# EAGLE board mainboard (EAGLE 7.7.0), part 1 of 4
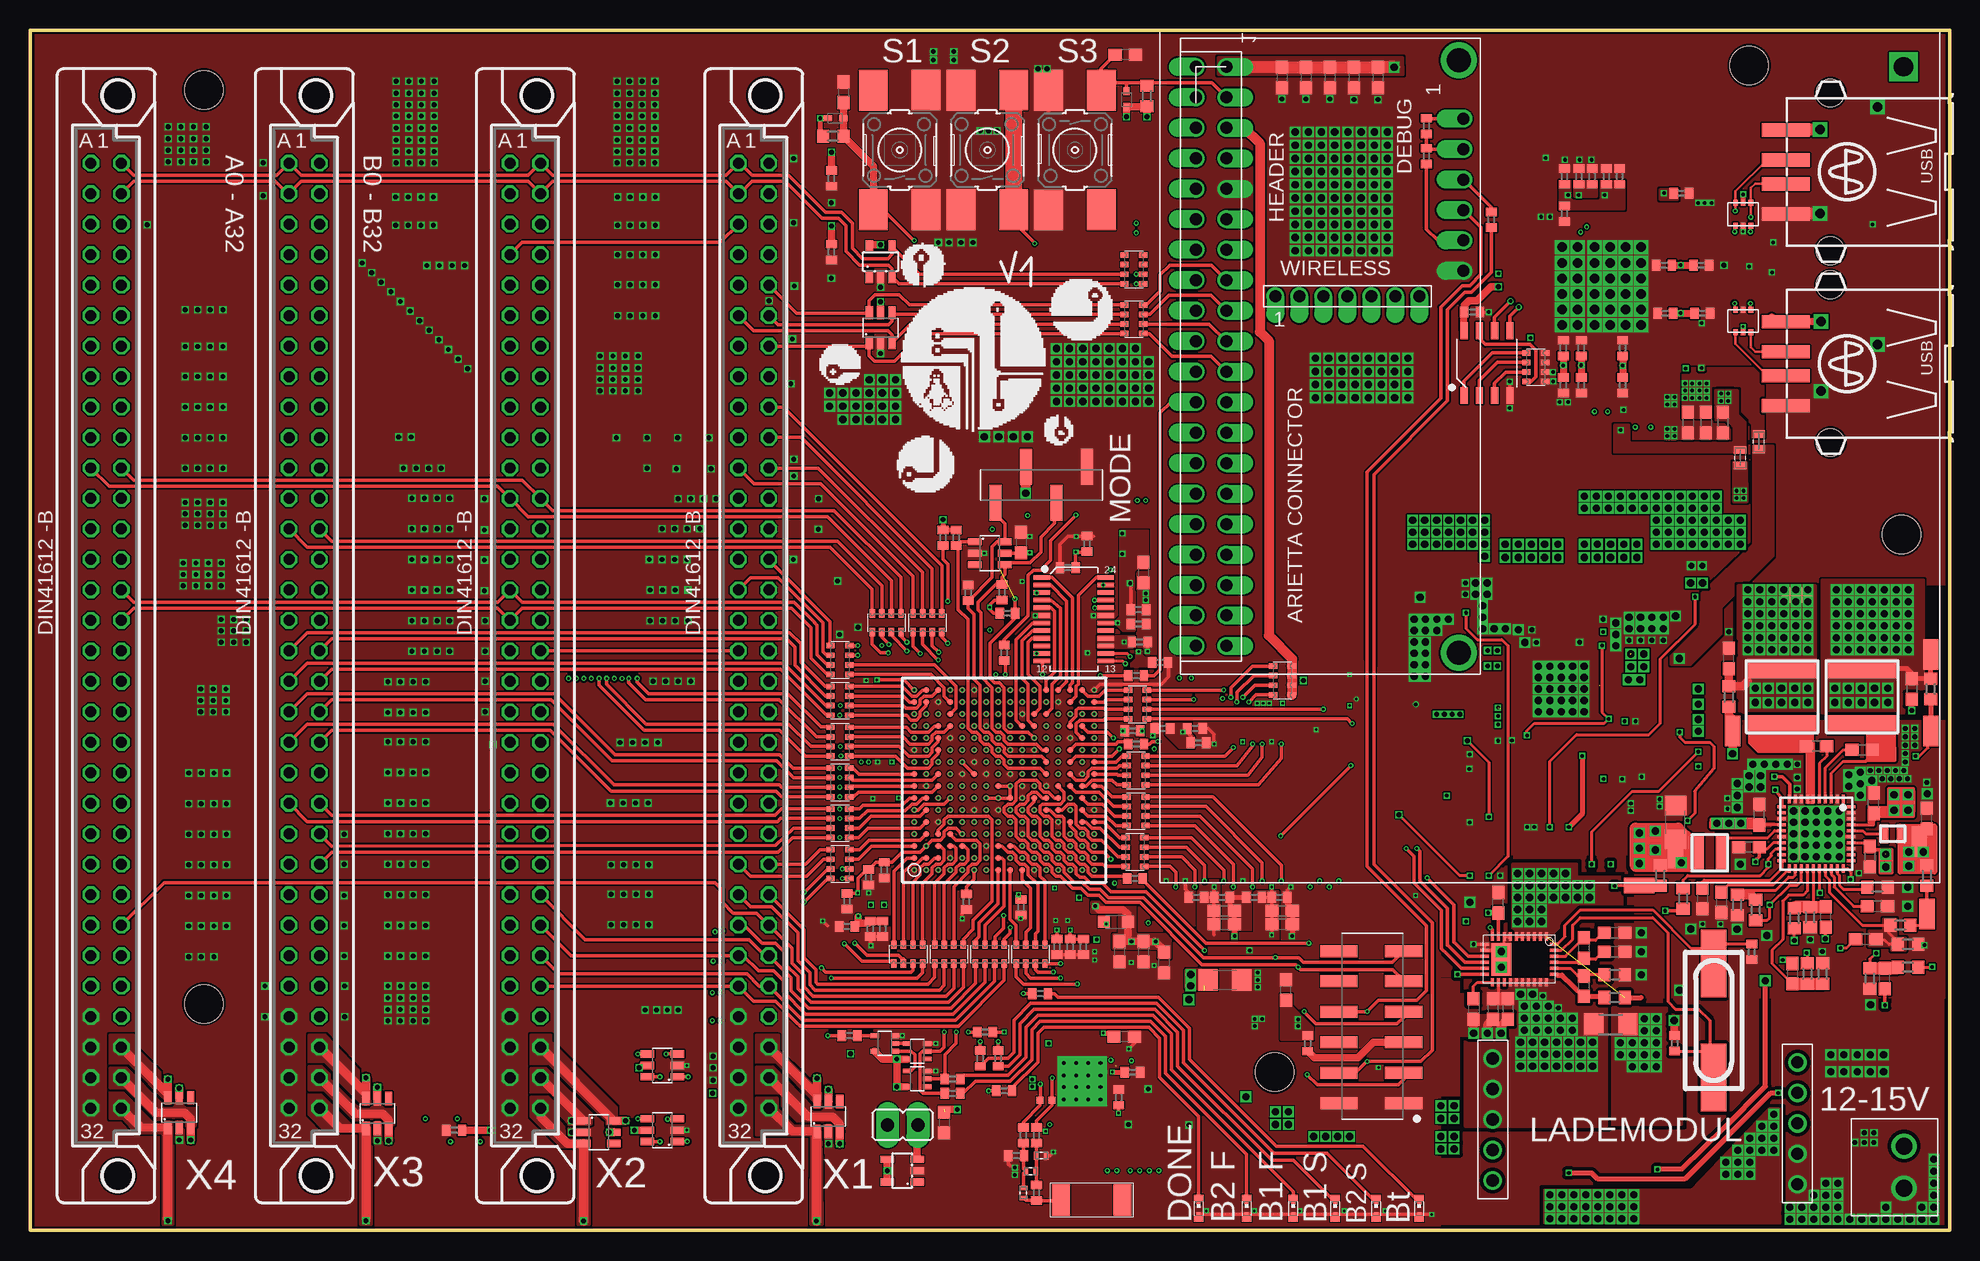
[diagram p6: board, top side]
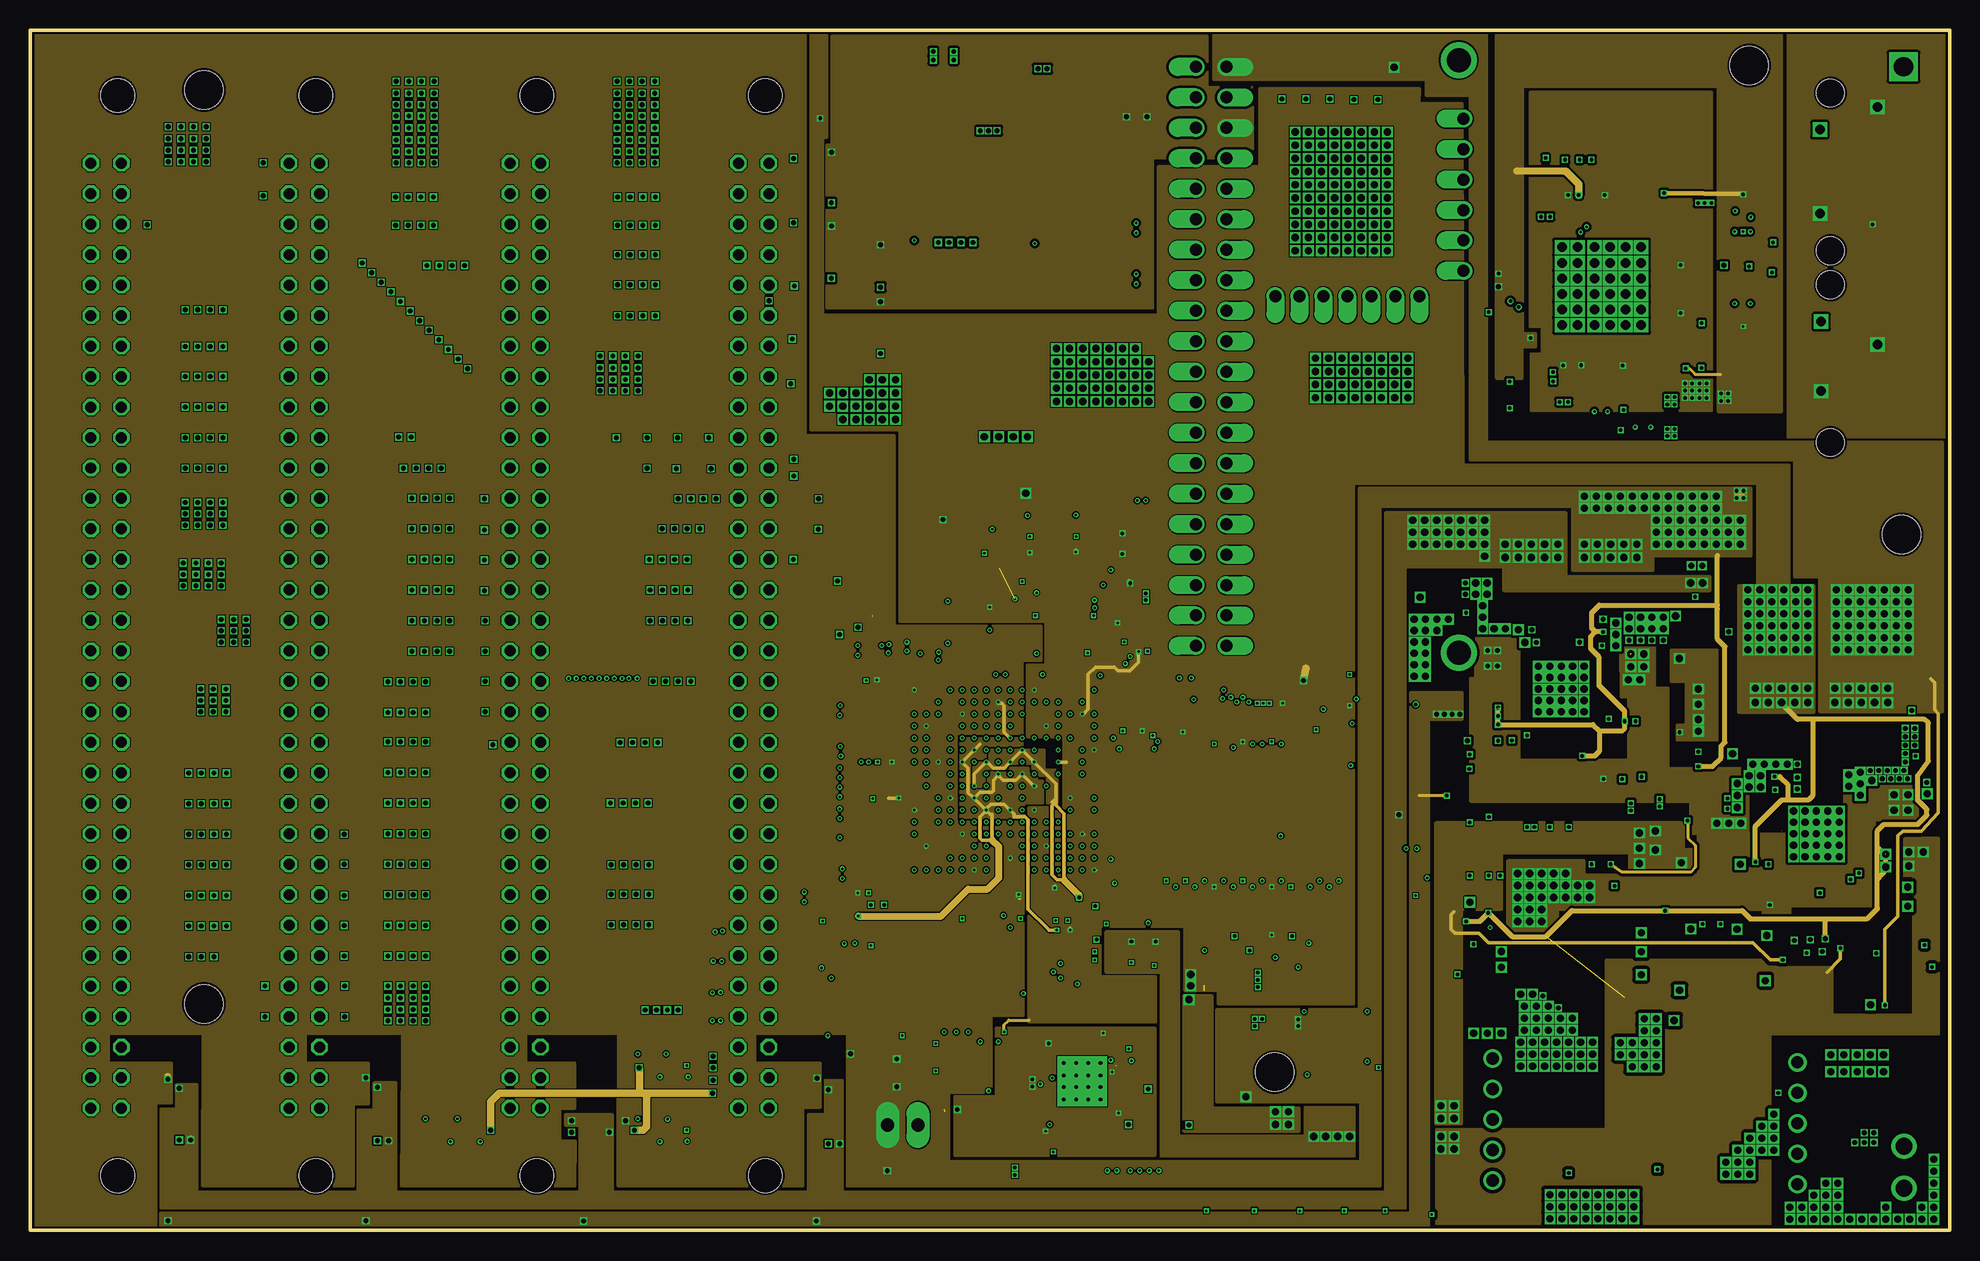
[diagram p7: board, inner layer VCC]
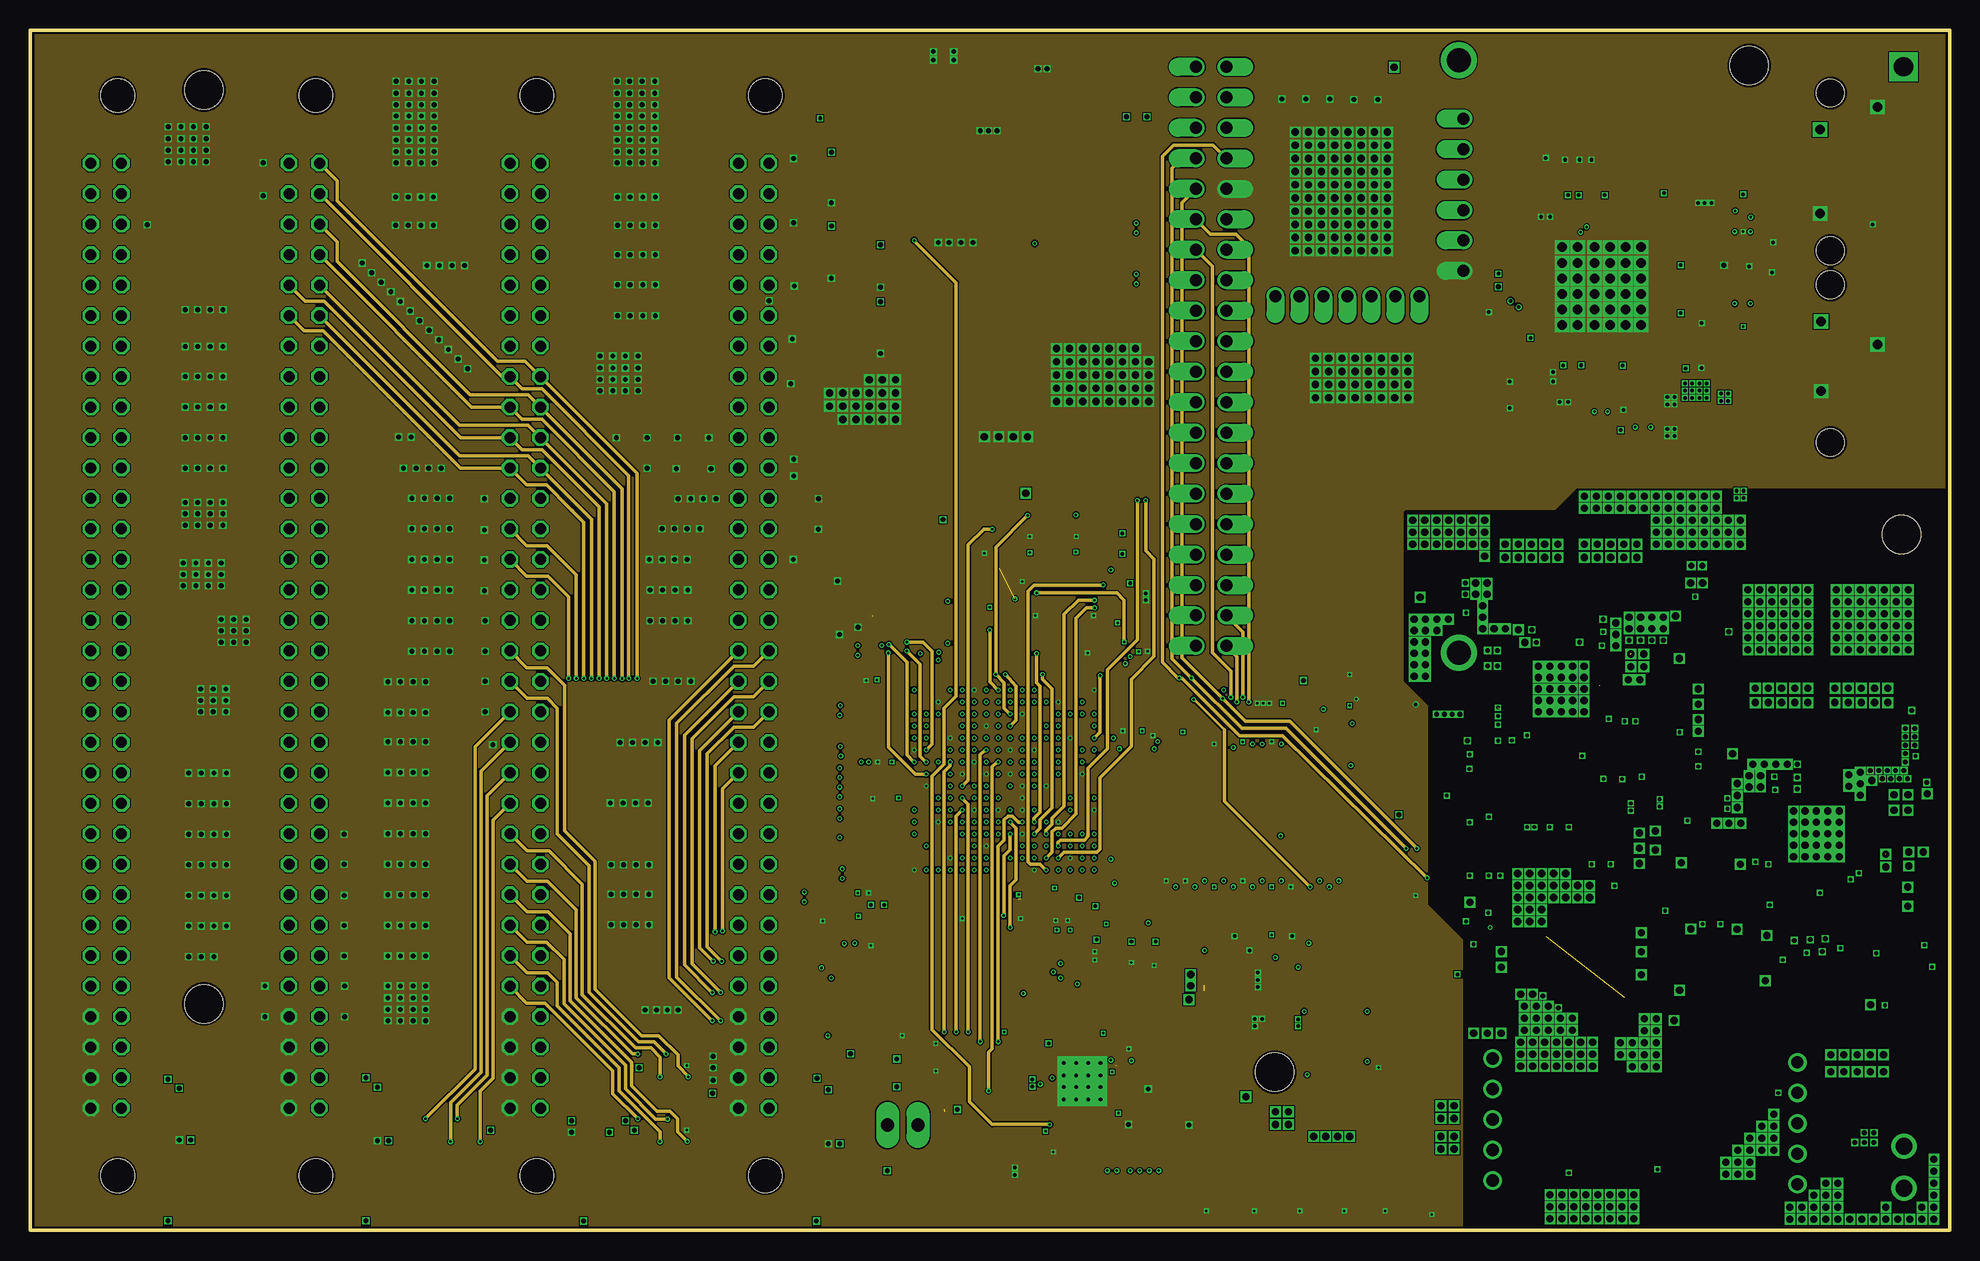
[diagram p8: board, inner layer FastSignal_Top]
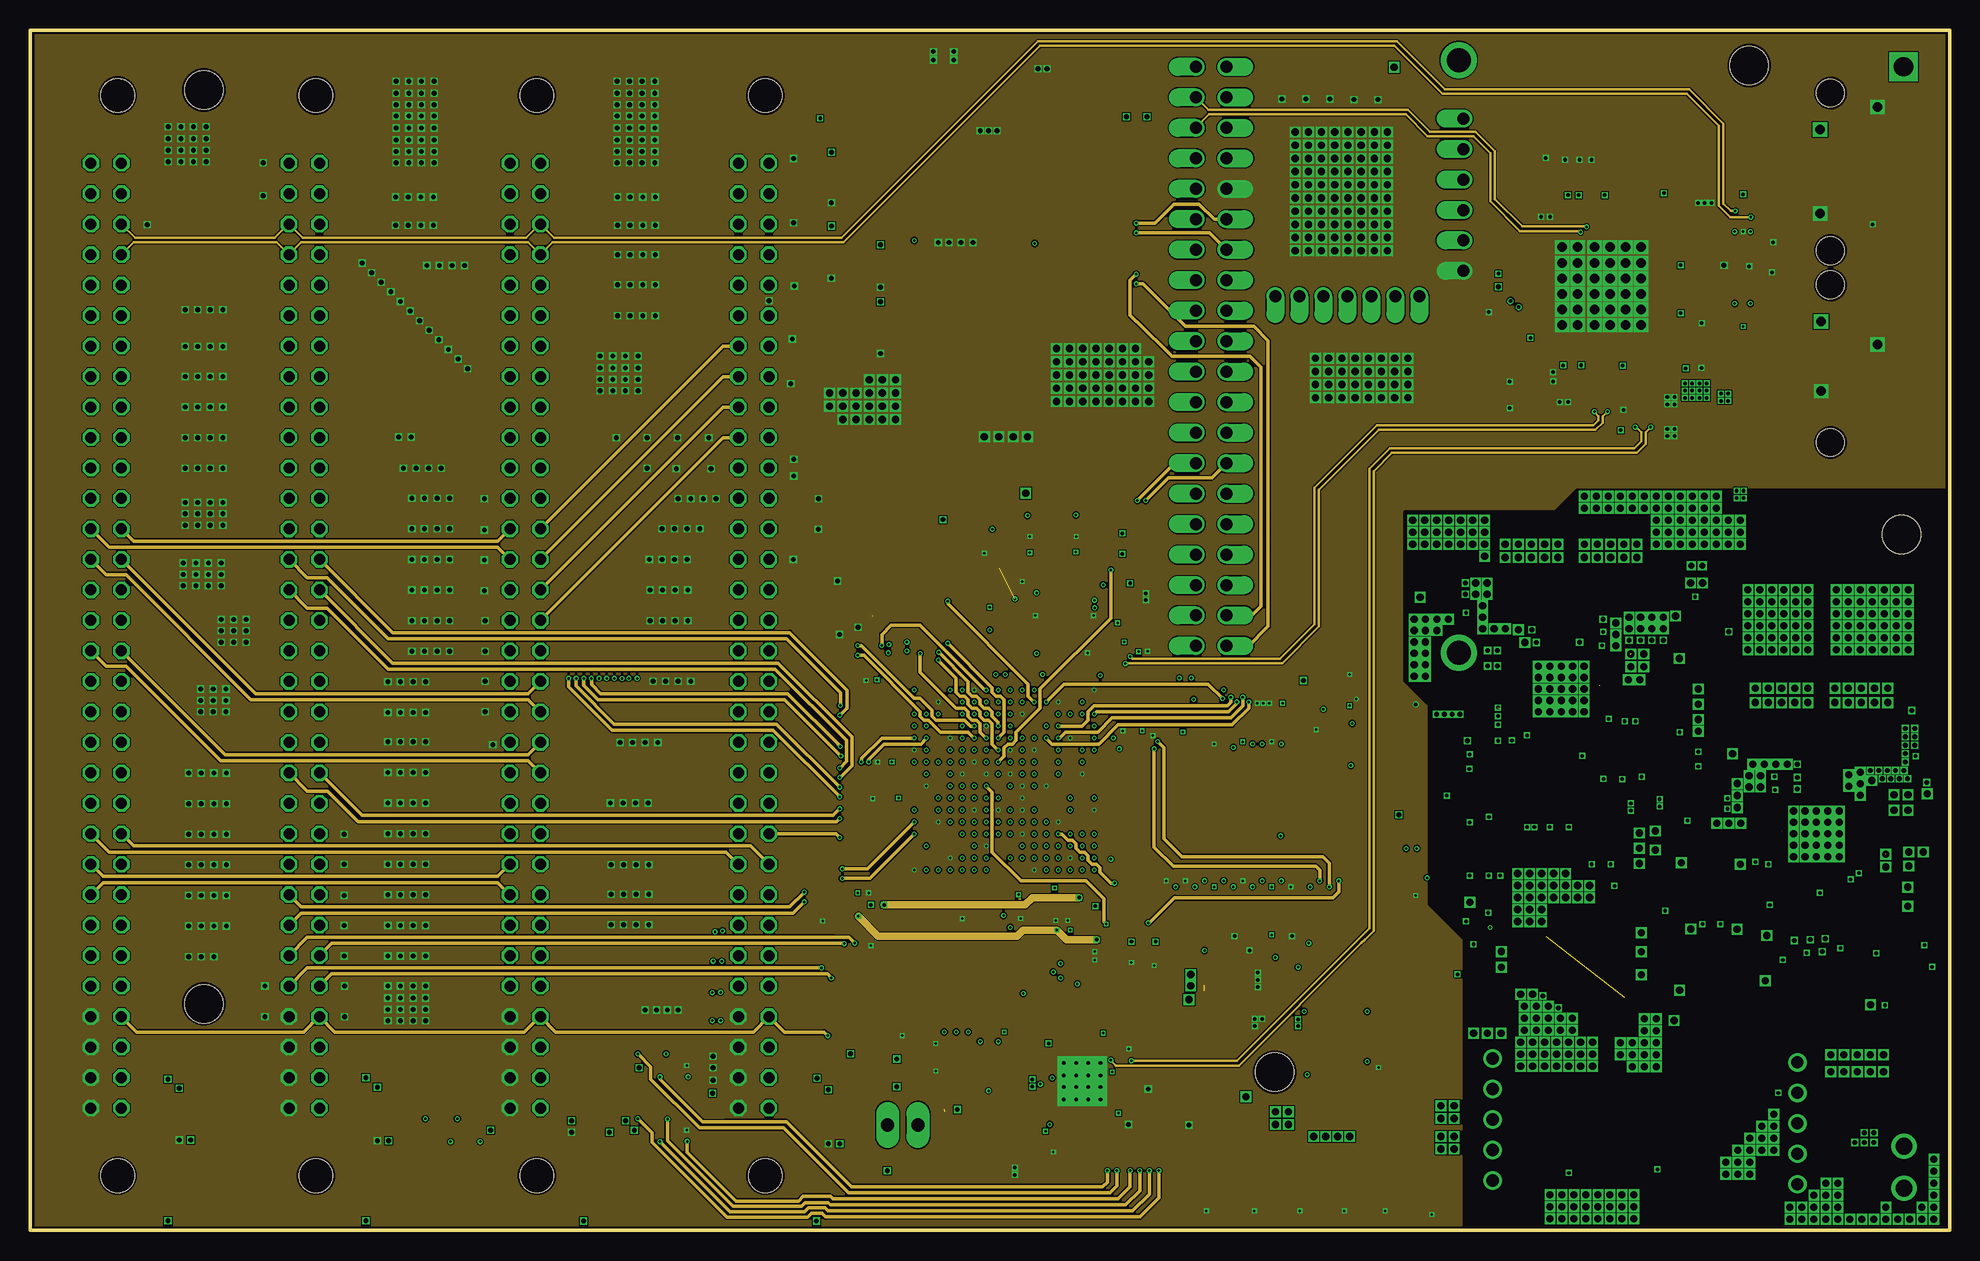
[diagram p9: board, inner layer FastSignal_Bottom]
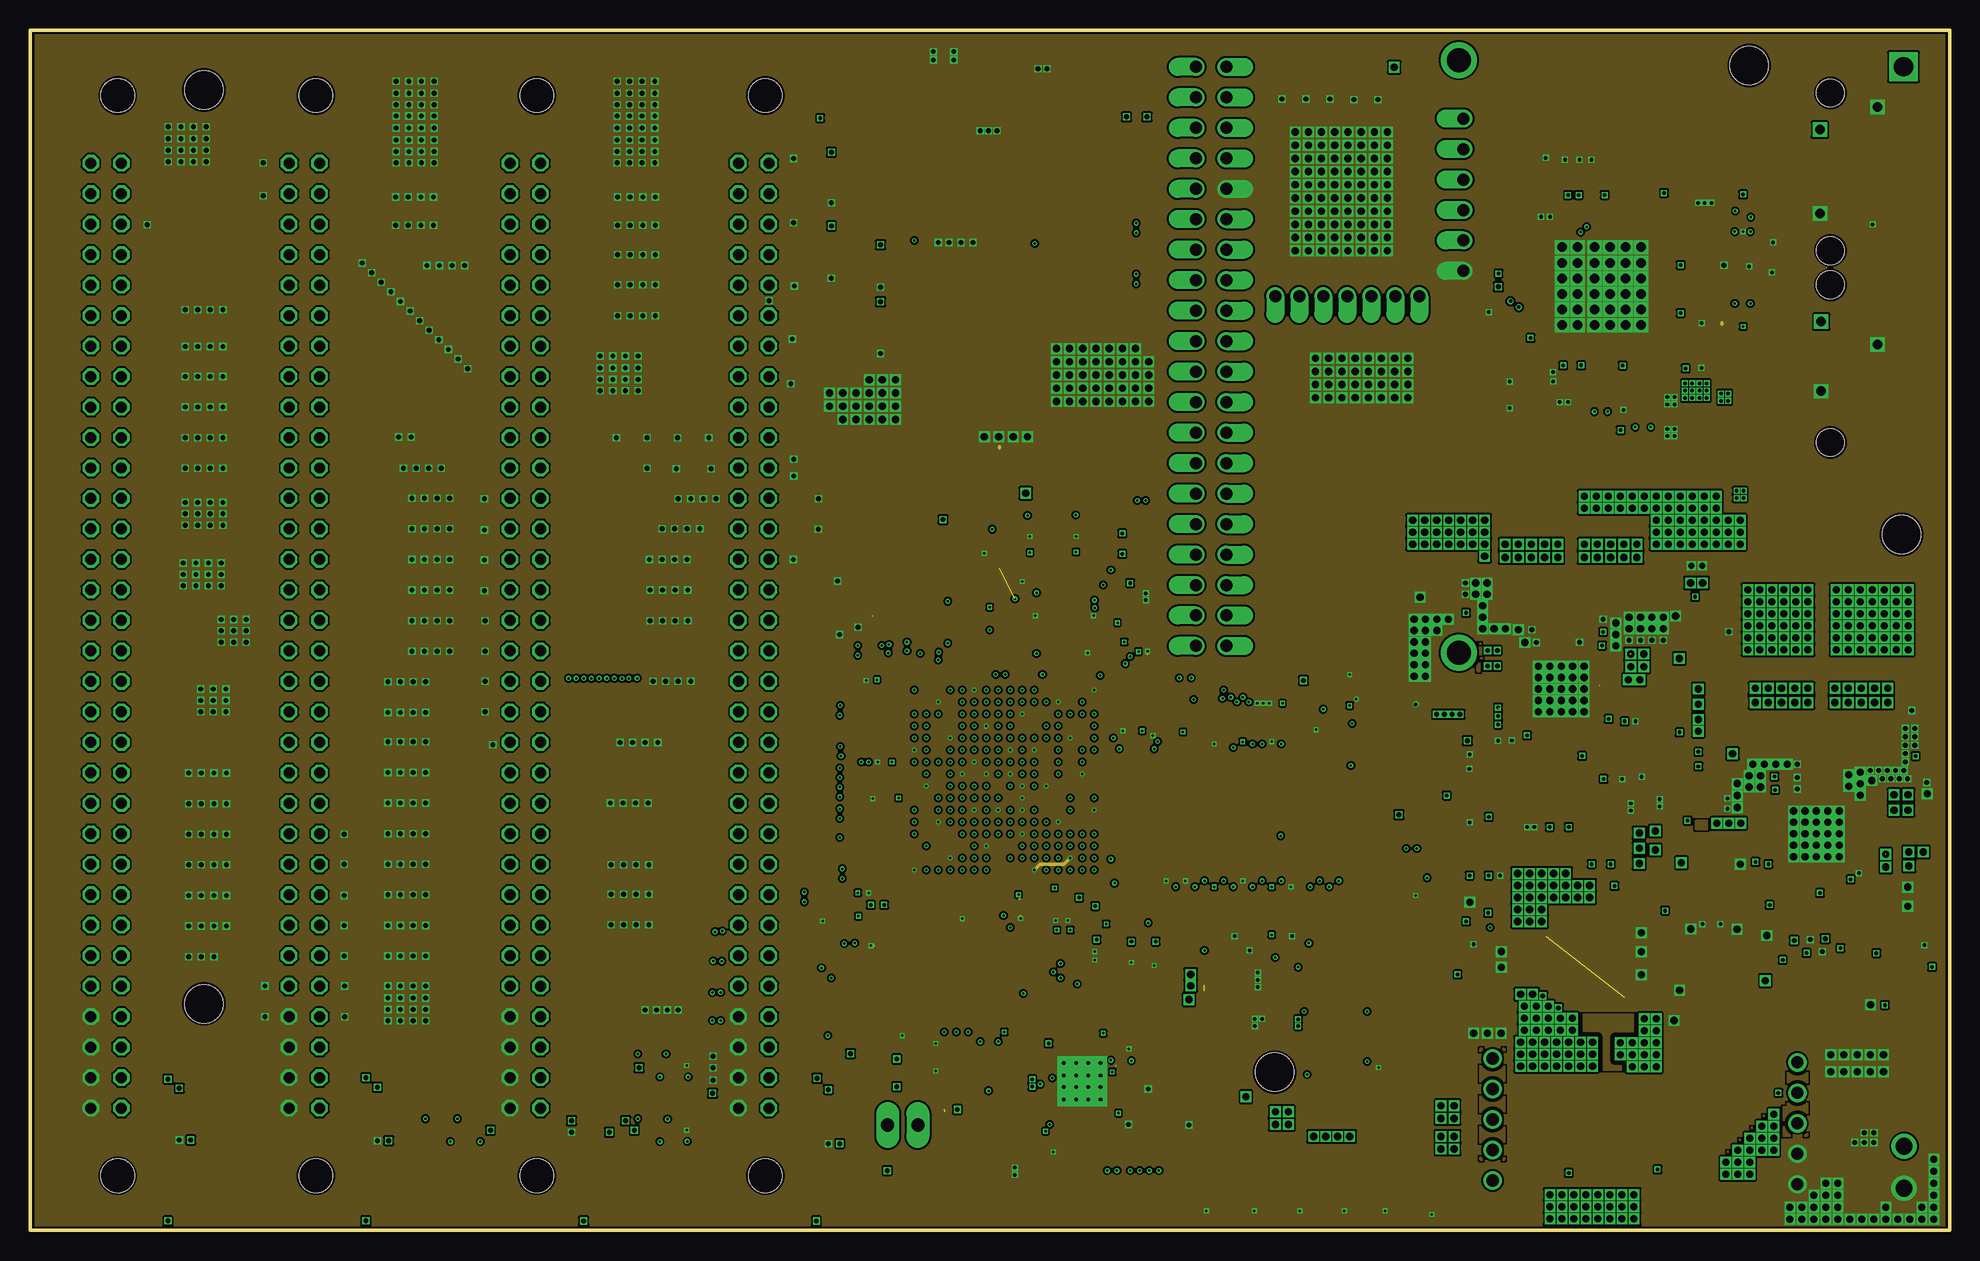
[diagram p10: board, inner layer GND]
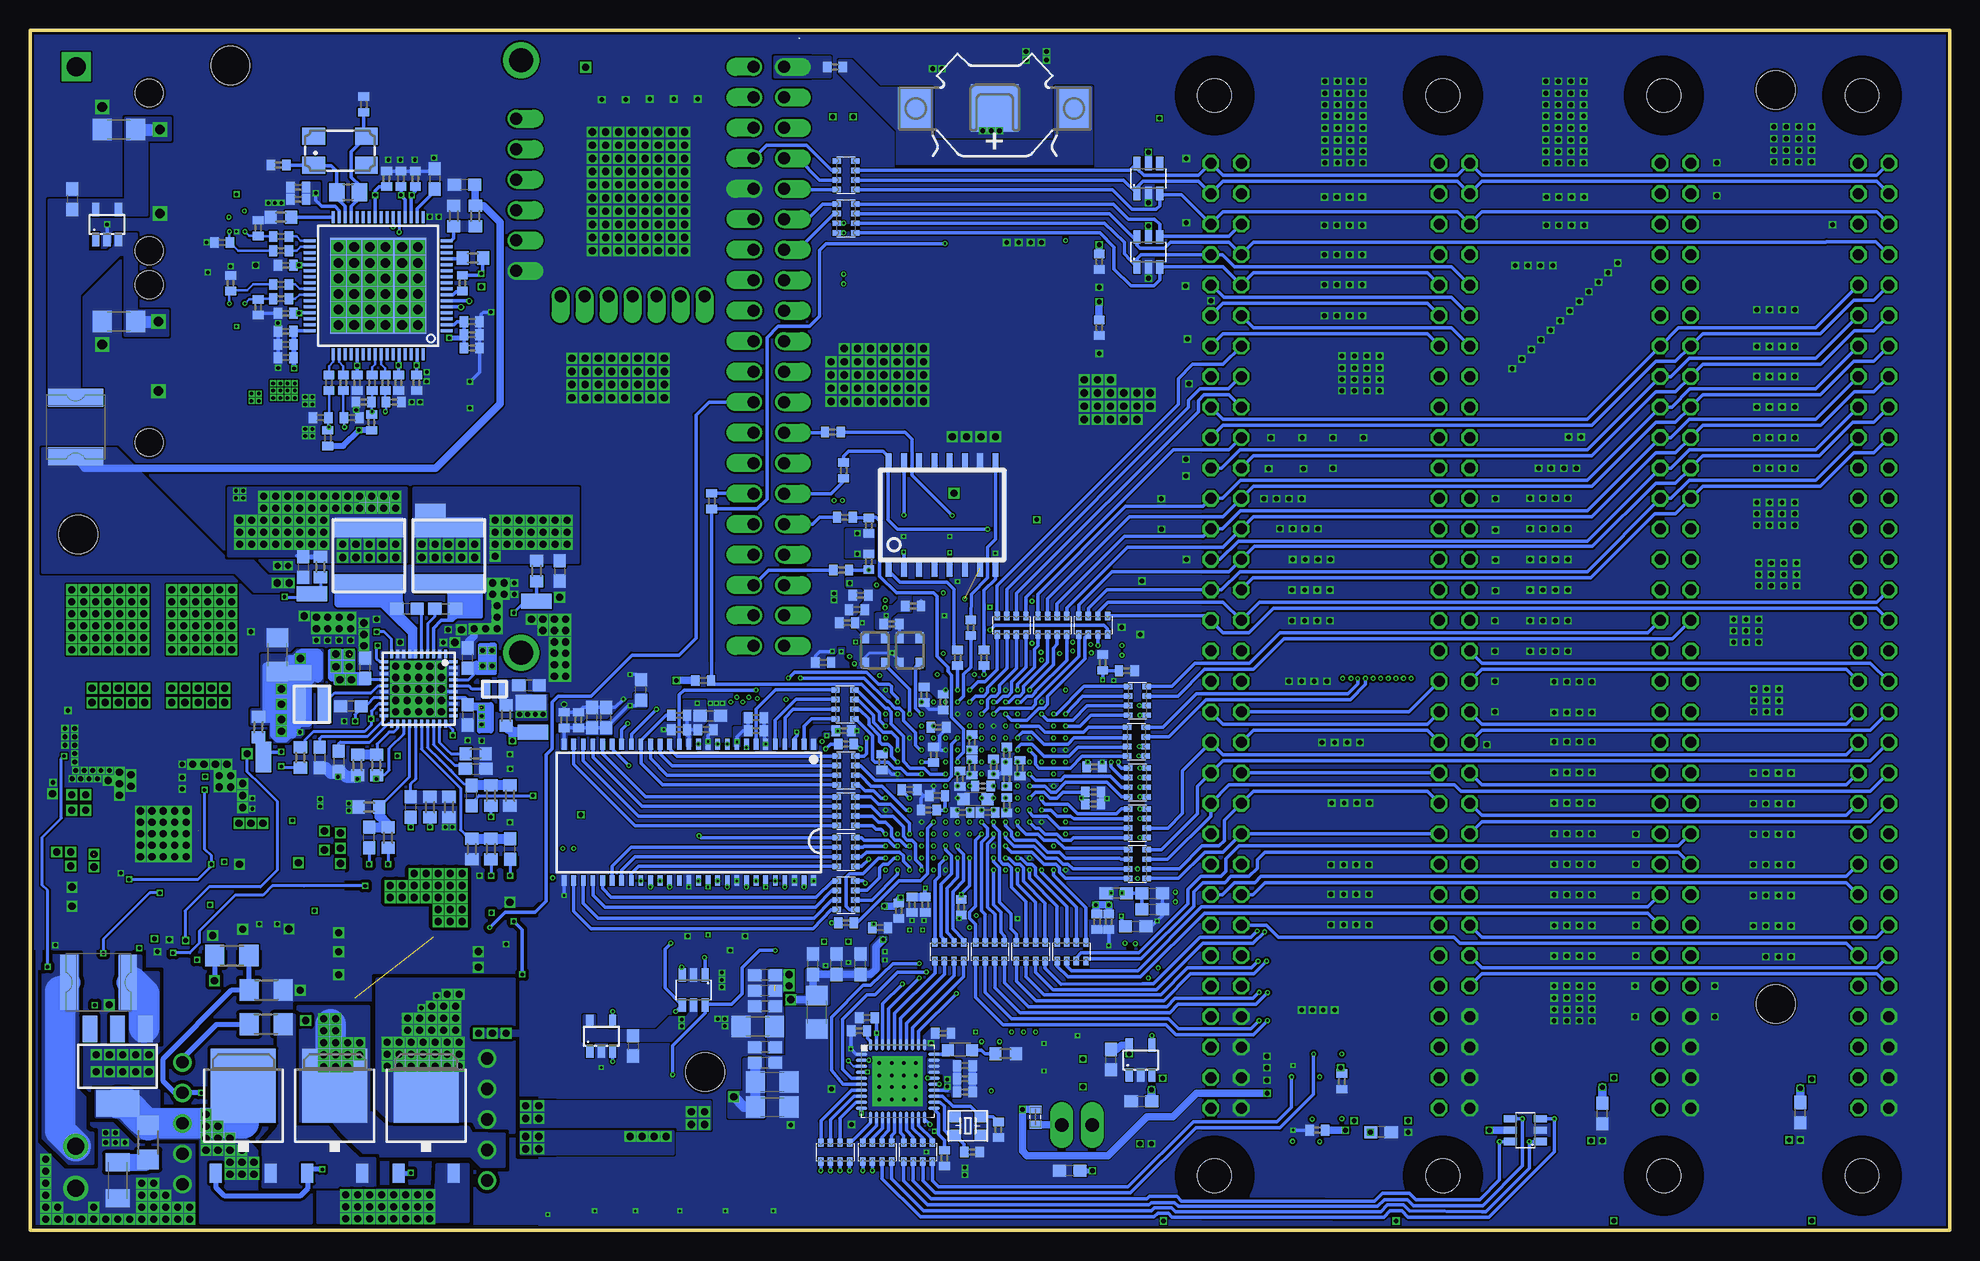
[diagram p11: board, bottom side, seen from below]

Size 160 x 100 mm. Coordinates in mm from the lower left corner, seen from the top.
Outline: 0,0 160,0 160,100 0,100 0,0
Copper layers (1+2*3+14*15+16): Signal_Top 0.018mm / dielectric 0.2mm / VCC 0.035mm / dielectric 0.36mm / FastSignal_Top 0.035mm / dielectric 0.3mm / FastSignal_Bottom 0.035mm / dielectric 0.36mm / GND 0.035mm / dielectric 0.2mm / Signal_Bottom 0.018mm
Design rules "Multi-CB_6L_100um-Tracks_OL35um-IL35um *": minimum track width 0.1mm, minimum drill 0.2mm, track to track 0.1mm, track to pad 0.1mm, pad to pad 0.1mm, via to via 0.1mm, smd to smd 0mil, copper to edge 0.2mm, drill to drill 0.2mm, minimum pad ring 0.1mm, minimum via ring 0.1mm, stop-mask expansion 2mil, vias tented up to drill 0.45mm, thermal gap 0.2mm
Net classes: 1 50 Ohm: width 0.381 mm, drill 0.203 mm; 2 58 Ohm: width 0.305 mm, drill 0.203 mm; 3 75 Ohm: width 0.203 mm, drill 0.203 mm; 4 100 Ohm: width 0.102 mm, drill 0.203 mm; 5 Power 2A: width 0.813 mm, drill 0.406 mm; 6 Power 1A: width 0.381 mm, drill 0.203 mm; 7 Power 0.5A: width 0.203 mm, drill 0.203 mm; 8 GND_signal: width 0.305 mm, drill 0.203 mm; 9 GND_default: width 0.381 mm, drill 0.203 mm; 10 GND_power: width 0.813 mm, drill 0.406 mm
Holes 3.2 mm at 14.5,18.85 14.5,95 143.3,97.05 156,57.95 103.75,13.15
bKeepout: area 58.1,28.4 to 58.2,28.6
tRestrict: area 69.2,16.4 to 70.2,16.9; area 75.2,11.6 to 75.9,12.4; area 79.7,13.1 to 80.3,14.1; area 83.3,8.9 to 83.7,9.3; area 82.9,3.7 to 83.8,6.8; area 72.6,13.3 to 73.6,14.1; area 83.9,19.1 to 84.5,20.4; area 79,24.1 to 79.5,24.6; area 83.2,24.1 to 84.5,24.9; area 77.3,28.4 to 77.9,28.9; area 74.5,31.2 to 76,32.1; area 76,32 to 76.8,32.6; 69 more areas
bRestrict: area 73.6,38.6 to 75.6,39.4; area 75,39.6 to 75.7,40.3; area 67.2,29 to 68.2,43.9; area 80.2,39.2 to 81,39.8; area 77,39.5 to 77.5,40.3; area 83.4,38.2 to 84.2,38.8; area 80.3,36.5 to 80.9,37.7; area 79.1,35.3 to 79.8,36.6; area 79,33.5 to 79.5,34.2; area 84.5,30.2 to 85,30.9; area 85.4,31.2 to 86,31.7; area 87.5,33.3 to 88,33.8; 37 more areas

## Footprints (pad centres in the part's own frame; a part is rotated, then mirrored left to right if it is on the bottom)
SWRA092B = smd 1.5 x 2.6: 1 -2.55,0; 2 2.55,0
C0402 = smd 0.7 x 0.9: 1 -0.65,0; 2 0.65,0
C0603 = smd 1.1 x 1: 1 -0.85,0; 2 0.85,0
C1206 = smd 1.6 x 1.8: 1 -1.4,0; 2 1.4,0
C1206K = smd 1.5 x 2: 1 -1.5,0; 2 1.5,0
WE-TVS_SOT23-6L = smd 0.6 x 1.1: 1 -0.95,-1.25; 2 0,-1.25; 3 0.95,-1.25; 4 0.95,1.25; 5 0,1.25; 6 -0.95,1.25
WE-TVS_SOT23-5L = smd 0.6 x 1.1: 1 -0.95,-1.25; 2 0,-1.25; 3 0.95,-1.25; 4 0.95,1.25; 5 -0.95,1.25
SOD523 = smd 0.7 x 0.5: A 0.7,0; C -0.6,0
SOT223 = smd 1.219 x 2.235: 1 -2.311,-3.099; 2 0,-3.099; 3 2.311,-3.099 | smd 3.6 x 2.2: 4 0,3.099
10MM_SM_COIN_CELL_CLIP = smd 2.9 x 3.5: +@1 -6.6,0; +@2 6.6,0 | smd 3.96 x 3.96: - 0,0
S25FL128P = smd 0.5 x 1.4: CS# 3.175,-4.45; GND 3.175,4.44; HOLD# -4.445,-4.45; NC -1.905,-4.45; PO0 1.905,-4.45; PO1 0.635,-4.45; PO2 -0.635,-4.45; PO3 1.905,4.44; PO4 0.635,4.44; PO5 -0.635,4.44; PO6 -1.905,4.44; SCK -4.445,4.44; SI -3.175,4.44; SO/PO7 4.445,-4.45; VCC -3.175,-4.45; WP#ACC 4.445,4.44
SSOP24-0.635-8.65X4MM = smd 0.381 x 1.397: 1 -3.493,-2.667; 2 -2.857,-2.667; 3 -2.223,-2.667; 4 -1.587,-2.667; 5 -0.953,-2.667; 6 -0.318,-2.667; 7 0.318,-2.667; 8 0.953,-2.667; 9 1.587,-2.667; 10 2.223,-2.667; 11 2.857,-2.667; 12 3.493,-2.667; 13 3.493,2.667; 14 2.857,2.667; 15 2.223,2.667; 16 1.587,2.667; 17 0.953,2.667; 18 0.318,2.667; 19 -0.318,2.667; 20 -0.953,2.667; 21 -1.587,2.667; 22 -2.223,2.667; 23 -2.857,2.667; 24 -3.493,2.667
QFN40-6X6 = smd 0.95 x 0.28: 1 -3.025,2.25; 2 -3.025,1.75; 3 -3.025,1.25; 4 -3.025,0.75; 5 -3.025,0.25; 6 -3.025,-0.25; 7 -3.025,-0.75; 8 -3.025,-1.25; 9 -3.025,-1.75; 10 -3.025,-2.25; 21 3.025,-2.25; 22 3.025,-1.75; 23 3.025,-1.25; 24 3.025,-0.75; 25 3.025,-0.25; 26 3.025,0.25; 27 3.025,0.75; 28 3.025,1.25; 29 3.025,1.75; 30 3.025,2.25 | smd 0.28 x 0.95: 11 -2.25,-3.025; 12 -1.75,-3.025; 13 -1.25,-3.025; 14 -0.75,-3.025; 15 -0.25,-3.025; 16 0.25,-3.025; 17 0.75,-3.025; 18 1.25,-3.025; 19 1.75,-3.025; 20 2.25,-3.025; 31 2.25,3.025; 32 1.75,3.025; 33 1.25,3.025; 34 0.75,3.025; 35 0.25,3.025; 36 -0.25,3.025; 37 -0.75,3.025; 38 -1.25,3.025; 39 -1.75,3.025; 40 -2.25,3.025 | drill 0.3 pad 1.1 square: EXP@1 -1.525,1.525; EXP@2 -0.5,1.525; EXP@3 0.5,1.525; EXP@4 1.525,1.525; EXP@5 -1.525,0.475; EXP@6 -0.5,0.475; EXP@7 0.5,0.475; EXP@8 1.525,0.475; EXP@9 -1.525,-0.475; EXP@10 -0.5,-0.475; EXP@11 0.5,-0.475; EXP@12 1.525,-0.475; EXP@13 -1.525,-1.525; EXP@14 -0.5,-1.525; EXP@15 0.5,-1.525; EXP@16 1.525,-1.525
LT8602 = smd 0.7 x 0.25: BIAS -2.9,-2.25; BST1 -2.9,0.75; BST2 -2.9,0.25; EN/UVLO 2.9,-1.75; FB1 2.9,0.25; FB2 2.9,-0.25; FB3 2.9,0.75; FB4 2.9,-0.75; GND_2 -2.9,1.75; GND_3 -2.9,-1.25; GND_4 -2.9,-1.75; INTVCC 2.9,1.25; PG1 -2.9,2.25; RT 2.9,1.75; RUN3 2.9,2.25; SW1 -2.9,1.25; SW2 -2.9,-0.25; SW2_2 -2.9,-0.75; TRKSS1 2.9,-2.25; VIN 2.9,-1.25 | smd 0.25 x 0.7: CPOR 2.25,2.9; GND_5 -1.25,-2.9; GND_6 0.25,-2.9; GND_7 -1.25,2.9; GND_8 0.25,2.9; NC 1.75,-2.9; PG2 -2.25,-2.9; PG3 -2.25,2.9; PG4 -1.75,-2.9; POREN -1.75,2.9; PVIN1 -0.75,2.9; PVIN2 -0.75,-2.9; PVIN3 0.75,2.9; PVIN4 0.75,-2.9; RST 1.75,2.9; RUN4 1.25,-2.9; SW3 -0.25,2.9; SW4 -0.25,-2.9; SYNC 1.25,2.9; TRKSS2 2.25,-2.9 | smd 4.42 x 4.42: GND_1 0,0
HTQFP-64-EXP = smd 1 x 0.25: 1 -5.7,3.75; 2 -5.7,3.25; 3 -5.7,2.75; 4 -5.7,2.25; 5 -5.7,1.75; 6 -5.7,1.25; 7 -5.7,0.75; 8 -5.7,0.25; 9 -5.7,-0.25; 10 -5.7,-0.75; 11 -5.7,-1.25; 12 -5.7,-1.75; 13 -5.7,-2.25; 14 -5.7,-2.75; 15 -5.7,-3.25; 16 -5.7,-3.75; 33 5.7,-3.75; 34 5.7,-3.25; 35 5.7,-2.75; 36 5.7,-2.25; 37 5.7,-1.75; 38 5.7,-1.25; 39 5.7,-0.75; 40 5.7,-0.25; 41 5.7,0.25; 42 5.7,0.75; 43 5.7,1.25; 44 5.7,1.75; 45 5.7,2.25; 46 5.7,2.75; 47 5.7,3.25; 48 5.7,3.75 | smd 0.25 x 1: 17 -3.75,-5.7; 18 -3.25,-5.7; 19 -2.75,-5.7; 20 -2.25,-5.7; 21 -1.75,-5.7; 22 -1.25,-5.7; 23 -0.75,-5.7; 24 -0.25,-5.7; 25 0.25,-5.7; 26 0.75,-5.7; 27 1.25,-5.7; 28 1.75,-5.7; 29 2.25,-5.7; 30 2.75,-5.7; 31 3.25,-5.7; 32 3.75,-5.7; 49 3.75,5.7; 50 3.25,5.7; 51 2.75,5.7; 52 2.25,5.7; 53 1.75,5.7; 54 1.25,5.7; 55 0.75,5.7; 56 0.25,5.7; 57 -0.25,5.7; 58 -0.75,5.7; 59 -1.25,5.7; 60 -1.75,5.7; 61 -2.25,5.7; 62 -2.75,5.7; 63 -3.25,5.7; 64 -3.75,5.7 | smd 8 x 8: EXP 0,0
LTC2947 = smd 0.25 x 0.7: AD0 1.75,-1.9; AD1/CS 2.25,-1.9; AGND 0.75,-1.9; AVCC 0.75,1.9; BYP 2.25,1.9; DGND 1.25,-1.9; DNC 1.25,1.9; DVCC 1.75,1.9; IM_1 -2.25,-1.9; IM_2 -1.75,-1.9; IM_3 -1.25,-1.9; IM_4 -0.75,-1.9; IM_5 -0.25,-1.9; IM_6 0.25,-1.9; IP_1 -2.25,1.9; IP_2 -1.75,1.9; IP_3 -1.25,1.9; IP_4 -0.75,1.9; IP_5 -0.25,1.9; IP_6 0.25,1.9 | smd 0.7 x 0.25: ALERT 2.9,-0.75; CFM -2.9,-0.25; CFP -2.9,0.25; CKLI -2.9,-0.75; CLKO -2.9,-1.25; GPIO 2.9,-1.25; OVDD 2.9,1.25; SCL 2.9,-0.25; SDI 2.9,0.75; SDO 2.9,0.25; VM -2.9,0.75; VP -2.9,1.25 | smd 1.7 x 2.7: DGND_2 1.5,0
SC70-5 = smd 0.4 x 0.7: 1 -0.65,-0.85; 2 0,-0.85; 3 0.65,-0.85; 4 0.65,0.85; 5 -0.65,0.85
SOIC-8 = smd 0.6 x 1.4: 1 -1.905,-2.7; 2 -0.635,-2.7; 3 0.635,-2.7; 4 1.905,-2.7; 5 1.905,2.7; 6 0.635,2.7; 7 -0.635,2.7; 8 -1.905,2.7
TSOP54-400 = smd 0.4 x 0.9: 1 -10.4,-5.68; 2 -9.6,-5.68; 3 -8.8,-5.68; 4 -8,-5.68; 5 -7.2,-5.68; 6 -6.4,-5.68; 7 -5.6,-5.68; 8 -4.8,-5.68; 9 -4,-5.68; 10 -3.2,-5.68; 11 -2.4,-5.68; 12 -1.6,-5.68; 13 -0.8,-5.68; 14 0,-5.68; 15 0.8,-5.68; 16 1.6,-5.68; 17 2.4,-5.68; 18 3.2,-5.68; 19 4,-5.68; 20 4.8,-5.68; 21 5.6,-5.68; 22 6.4,-5.68; 23 7.2,-5.68; 24 8,-5.68; 25 8.8,-5.68; 26 9.6,-5.68; 27 10.4,-5.68; 28 10.4,5.68; 29 9.6,5.68; 30 8.8,5.68; 31 8,5.68; 32 7.2,5.68; 33 6.4,5.68; 34 5.6,5.68; 35 4.8,5.68; 36 4,5.68; 37 3.2,5.68; 38 2.4,5.68; 39 1.6,5.68; 40 0.8,5.68; 41 0,5.68; 42 -0.8,5.68; 43 -1.6,5.68; 44 -2.4,5.68; 45 -3.2,5.68; 46 -4,5.68; 47 -4.8,5.68; 48 -5.6,5.68; 49 -6.4,5.68; 50 -7.2,5.68; 51 -8,5.68; 52 -8.8,5.68; 53 -9.6,5.68; 54 -10.4,5.68
61001221121 = smd 1 x 3.1: 1 -6.35,-2.7; 2 -3.81,-2.7; 3 -1.27,-2.7; 4 1.27,-2.7; 5 3.81,-2.7; 6 6.35,-2.7; 7 6.35,2.7; 8 3.81,2.7; 9 1.27,2.7; 10 -1.27,2.7; 11 -3.81,2.7; 12 -6.35,2.7
61000418221 = smd 1 x 3: 1 -3.81,-1.5; 2 -1.27,1.5; 3 1.27,-1.5; 4 3.81,1.5
691321100002 = drill 1.4: 1 -3.5,0; 2 0,0
61300511821 = drill 1.02: 1 -5.08,0; 2 -2.54,0; 3 0,0; 4 2.54,0; 5 5.08,0
L2012C = smd 1 x 1: 1 -1,0; 2 1,0
WE-KI_0603_B = smd 0.64 x 1.02: 1 -0.64,0; 2 0.64,0
WE-KI_0402A = smd 0.65 x 0.375: 1 0,-0.412; 2 0,0.412
NR6028T100M = smd 1.6 x 5.7: 1 -2.35,0; 2 2.35,0
IHHP-0806AZ-01 = smd 0.65 x 1.6: P$1 -0.675,0; P$2 0.675,0
SRN3012TA = smd 1.1 x 3.2: P$1 -1.05,0; P$2 1.05,0
SMARTLED-TTW = smd 0.8 x 0.5: A 0,-0.875; C 0,0.875 | smd 0.35 x 0.35: A@1 0,-0.5; C@1 0,0.5
SMD1,27-2,54 = smd 1.27 x 2.54: 1 0,0
TO252 = smd 1 x 1.6: 1 -2.28,-4.8; 2 2.28,-4.8 | smd 5.4 x 6.2: 3 0,2.5
CTS406 = smd 1.9 x 1.4: 1 -2.2,-1.2; 2 2.2,-1.2; 3 2.2,1.2; 4 -2.2,1.2
CTS402_3.2X2.5 = smd 1 x 0.9: 1 -1.075,-0.775; 2 1.075,-0.775; 3 1.074,0.775; 4 -1.075,0.775
R0402 = smd 0.7 x 0.9: 1 -0.65,0; 2 0.65,0
R0603 = smd 1 x 1.1: 1 -0.85,0; 2 0.85,0
R0805 = smd 1.3 x 1.5: 1 -0.95,0; 2 0.95,0
R1206 = smd 1.6 x 1.803: 1 -1.422,0; 2 1.422,0
EXBV8V = smd 0.45 x 0.7: 1 -1.2,-0.775; 2 -0.4,-0.775; 3 0.4,-0.775; 4 1.2,-0.775; 5 1.2,0.775; 6 0.4,0.775; 7 -0.4,0.775; 8 -1.2,0.775
TASTER_SMD = smd 3.4 x 2.4: 1 -4.987,2.203; 2 4.989,2.202; 3 -4.989,-2.193; 4 5,-2.197
TP06SQ = smd 0.6 x 0.6: TP 0,0
FT256 = smd 0.5 x 0.5: A1 -7.5,7.5; A2 -6.5,7.5; A3 -5.5,7.5; A4 -4.5,7.5; A5 -3.5,7.5; A6 -2.5,7.5; A7 -1.5,7.5; A8 -0.5,7.5; A9 0.5,7.5; A10 1.5,7.5; A11 2.5,7.5; A12 3.5,7.5; A13 4.5,7.5; A14 5.5,7.5; A15 6.5,7.5; A16 7.5,7.5; B1 -7.5,6.5; B2 -6.5,6.5; B3 -5.5,6.5; B4 -4.5,6.5; B5 -3.5,6.5; B6 -2.5,6.5; B7 -1.5,6.5; B8 -0.5,6.5; B9 0.5,6.5; B10 1.5,6.5; B11 2.5,6.5; B12 3.5,6.5; B13 4.5,6.5; B14 5.5,6.5; B15 6.5,6.5; B16 7.5,6.5; C1 -7.5,5.5; C2 -6.5,5.5; C3 -5.5,5.5; C4 -4.5,5.5; C5 -3.5,5.5; C6 -2.5,5.5; C7 -1.5,5.5; C8 -0.5,5.5; C9 0.5,5.5; C10 1.5,5.5; C11 2.5,5.5; C12 3.5,5.5; C13 4.5,5.5; C14 5.5,5.5; C15 6.5,5.5; C16 7.5,5.5; D1 -7.5,4.5; D2 -6.5,4.5; D3 -5.5,4.5; D4 -4.5,4.5; D5 -3.5,4.5; D6 -2.5,4.5; D7 -1.5,4.5; D8 -0.5,4.5; D9 0.5,4.5; D10 1.5,4.5; D11 2.5,4.5; D12 3.5,4.5; D13 4.5,4.5; D14 5.5,4.5; D15 6.5,4.5; D16 7.5,4.5; E1 -7.5,3.5; E2 -6.5,3.5; E3 -5.5,3.5; E4 -4.5,3.5; E5 -3.5,3.5; E6 -2.5,3.5; E7 -1.5,3.5; E8 -0.5,3.5; E9 0.5,3.5; E10 1.5,3.5; E11 2.5,3.5; E12 3.5,3.5; E13 4.5,3.5; E14 5.5,3.5; E15 6.5,3.5; E16 7.5,3.5; F1 -7.5,2.5; F2 -6.5,2.5; F3 -5.5,2.5; F4 -4.5,2.5; F5 -3.5,2.5; F6 -2.5,2.5; F7 -1.5,2.5; F8 -0.5,2.5; F9 0.5,2.5; F10 1.5,2.5; F11 2.5,2.5; F12 3.5,2.5; F13 4.5,2.5; F14 5.5,2.5; F15 6.5,2.5; F16 7.5,2.5; G1 -7.5,1.5; G2 -6.5,1.5; G3 -5.5,1.5; G4 -4.5,1.5; G5 -3.5,1.5; G6 -2.5,1.5; G7 -1.5,1.5; G8 -0.5,1.5; G9 0.5,1.5; G10 1.5,1.5; G11 2.5,1.5; G12 3.5,1.5; G13 4.5,1.5; G14 5.5,1.5; G15 6.5,1.5; G16 7.5,1.5; H1 -7.5,0.5; H2 -6.5,0.5; H3 -5.5,0.5; H4 -4.5,0.5; H5 -3.5,0.5; H6 -2.5,0.5; H7 -1.5,0.5; H8 -0.5,0.5; H9 0.5,0.5; H10 1.5,0.5; H11 2.5,0.5; H12 3.5,0.5; H13 4.5,0.5; H14 5.5,0.5; H15 6.5,0.5; H16 7.5,0.5; J1 -7.5,-0.5; J2 -6.5,-0.5; J3 -5.5,-0.5; J4 -4.5,-0.5; J5 -3.5,-0.5; J6 -2.5,-0.5; J7 -1.5,-0.5; J8 -0.5,-0.5; J9 0.5,-0.5; J10 1.5,-0.5; J11 2.5,-0.5; J12 3.5,-0.5; J13 4.5,-0.5; J14 5.5,-0.5; J15 6.5,-0.5; J16 7.5,-0.5; K1 -7.5,-1.5; K2 -6.5,-1.5; K3 -5.5,-1.5; K4 -4.5,-1.5; K5 -3.5,-1.5; K6 -2.5,-1.5; K7 -1.5,-1.5; K8 -0.5,-1.5; K9 0.5,-1.5; K10 1.5,-1.5; K11 2.5,-1.5; K12 3.5,-1.5; K13 4.5,-1.5; K14 5.5,-1.5; K15 6.5,-1.5; K16 7.5,-1.5; L1 -7.5,-2.5; L2 -6.5,-2.5; L3 -5.5,-2.5; L4 -4.5,-2.5; L5 -3.5,-2.5; L6 -2.5,-2.5; L7 -1.5,-2.5; L8 -0.5,-2.5; L9 0.5,-2.5; L10 1.5,-2.5; L11 2.5,-2.5; L12 3.5,-2.5; L13 4.5,-2.5; L14 5.5,-2.5; L15 6.5,-2.5; L16 7.5,-2.5; M1 -7.5,-3.5; M2 -6.5,-3.5; M3 -5.5,-3.5; M4 -4.5,-3.5; M5 -3.5,-3.5; M6 -2.5,-3.5; M7 -1.5,-3.5; M8 -0.5,-3.5; M9 0.5,-3.5; M10 1.5,-3.5; M11 2.5,-3.5; M12 3.5,-3.5; M13 4.5,-3.5; M14 5.5,-3.5; M15 6.5,-3.5; M16 7.5,-3.5; N1 -7.5,-4.5; N2 -6.5,-4.5; N3 -5.5,-4.5; N4 -4.5,-4.5; N5 -3.5,-4.5; N6 -2.5,-4.5; N7 -1.5,-4.5; N8 -0.5,-4.5; N9 0.5,-4.5; N10 1.5,-4.5; N11 2.5,-4.5; N12 3.5,-4.5; N13 4.5,-4.5; N14 5.5,-4.5; N15 6.5,-4.5; N16 7.5,-4.5; P1 -7.5,-5.5; P2 -6.5,-5.5; P3 -5.5,-5.5; P4 -4.5,-5.5; P5 -3.5,-5.5; P6 -2.5,-5.5; P7 -1.5,-5.5; P8 -0.5,-5.5; P9 0.5,-5.5; P10 1.5,-5.5; P11 2.5,-5.5; P12 3.5,-5.5; P13 4.5,-5.5; P14 5.5,-5.5; P15 6.5,-5.5; P16 7.5,-5.5; R1 -7.5,-6.5; R2 -6.5,-6.5; R3 -5.5,-6.5; R4 -4.5,-6.5; R5 -3.5,-6.5; R6 -2.5,-6.5; R7 -1.5,-6.5; R8 -0.5,-6.5; R9 0.5,-6.5; R10 1.5,-6.5; R11 2.5,-6.5; R12 3.5,-6.5; R13 4.5,-6.5; R14 5.5,-6.5; R15 6.5,-6.5; R16 7.5,-6.5; T1 -7.5,-7.5; T2 -6.5,-7.5; T3 -5.5,-7.5; T4 -4.5,-7.5; T5 -3.5,-7.5; T6 -2.5,-7.5; T7 -1.5,-7.5; T8 -0.5,-7.5; T9 0.5,-7.5; T10 1.5,-7.5; T11 2.5,-7.5; T12 3.5,-7.5; T13 4.5,-7.5; T14 5.5,-7.5; T15 6.5,-7.5; T16 7.5,-7.5
ARIETTA = drill 1 offset: 1 -8.89,24.13; 2 -11.43,24.13; 3 -8.89,21.59; 4 -11.43,21.59; 5 -8.89,19.05; 6 -11.43,19.05; 7 -8.89,16.51; 8 -11.43,16.51; 9 -8.89,13.97; 10 -11.43,13.97; 11 -8.89,11.43; 12 -11.43,11.43; 13 -8.89,8.89; 14 -11.43,8.89; 15 -8.89,6.35; 16 -11.43,6.35; 17 -8.89,3.81; 18 -11.43,3.81; 19 -8.89,1.27; 20 -11.43,1.27; 21 -8.89,-1.27; 22 -11.43,-1.27; 23 -8.89,-3.81; 24 -11.43,-3.81; 25 -8.89,-6.35; 26 -11.43,-6.35; 27 -8.89,-8.89; 28 -11.43,-8.89; 29 -8.89,-11.43; 30 -11.43,-11.43; 31 -8.89,-13.97; 32 -11.43,-13.97; 33 -8.89,-16.51; 34 -11.43,-16.51; 35 -8.89,-19.05; 36 -11.43,-19.05; 37 -8.89,-21.59; 38 -11.43,-21.59; 39 -8.89,-24.13; 40 -11.43,-24.13; D1 10.89,19.82; D2 10.89,17.28; D3 10.89,14.74; D4 10.89,12.2; D5 10.89,9.66; D6 10.89,7.12; W1 -4.795,5.015; W2 -2.795,5.015; W3 -0.795,5.015; W4 1.205,5.015; W5 3.205,5.015; W6 5.205,5.015; W7 7.205,5.015 | drill 2: 98 10.49,24.7; 99 10.49,-24.7 | drill 1.6 square: P$3 47.57,24.13
ASE = smd 0.9 x 0.65: 1 -1.05,-0.825; 2 1.05,-0.825; 3 1.05,0.825; 4 -1.05,0.825
NUF2221W1 = smd 0.5 x 0.399: 1 0,0.635; 2 0,0; 3 0,-0.635; 4 1.9,-0.635; 5 1.9,0; 6 1.9,0.635
MF-SMDF050 = smd 1.5 x 4.6: 1 -2.45,0; 2 2.45,0
FAB64S = drill 0.914 octagon: A1 -1.27,39.37; A2 -1.27,36.83; A3 -1.27,34.29; A4 -1.27,31.75; A5 -1.27,29.21; A6 -1.27,26.67; A7 -1.27,24.13; A8 -1.27,21.59; A9 -1.27,19.05; A10 -1.27,16.51; A11 -1.27,13.97; A12 -1.27,11.43; A13 -1.27,8.89; A14 -1.27,6.35; A15 -1.27,3.81; A16 -1.27,1.27; A17 -1.27,-1.27; A18 -1.27,-3.81; A19 -1.27,-6.35; A20 -1.27,-8.89; A21 -1.27,-11.43; A22 -1.27,-13.97; A23 -1.27,-16.51; A24 -1.27,-19.05; A25 -1.27,-21.59; A26 -1.27,-24.13; A27 -1.27,-26.67; A28 -1.27,-29.21; A29 -1.27,-31.75; A30 -1.27,-34.29; A31 -1.27,-36.83; A32 -1.27,-39.37; B1 1.27,39.37; B2 1.27,36.83; B3 1.27,34.29; B4 1.27,31.75; B5 1.27,29.21; B6 1.27,26.67; B7 1.27,24.13; B8 1.27,21.59; B9 1.27,19.05; B10 1.27,16.51; B11 1.27,13.97; B12 1.27,11.43; B13 1.27,8.89; B14 1.27,6.35; B15 1.27,3.81; B16 1.27,1.27; B17 1.27,-1.27; B18 1.27,-3.81; B19 1.27,-6.35; B20 1.27,-8.89; B21 1.27,-11.43; B22 1.27,-13.97; B23 1.27,-16.51; B24 1.27,-19.05; B25 1.27,-21.59; B26 1.27,-24.13; B27 1.27,-26.67; B28 1.27,-29.21; B29 1.27,-31.75; B30 1.27,-34.29; B31 1.27,-36.83; B32 1.27,-39.37 | hole 2.794: 0.965,-45.009; 0.965,45.009
ABLS2-4.000MHZ-D4Y-T = smd 5.6 x 2.1: 1 -4.75,0; 2 4.75,0
USB-A003 = smd 1.12 x 4: 1 -3.5,14; 2 -1,14; 3 1,14; 4 3.5,14 | hole 2.3: -6.57,10.28; 6.57,10.28
JMP2 = drill 1.1 pad 1.93 long: 1 0,-1.27; 2 0,1.27

## Placement (x,y rotation side)
ANT1  SWRA092B  [SWRA092B]  88.5,2.5 0 top
C1  100n  [C0402]  86.5,55.2 180 top
C2  47n  [C0402]  84.4,36.2 0 bottom
C3  470n  [C0402]  87.8,23.6 90 top
C4  470n  [C0402]  86.7,23.6 90 top
C5  47n  [C0402]  84.3,41.9 0 bottom
C6  47n  [C0402]  84.7,39.6 90 bottom
C7  47n  [C0402]  89,39 270 bottom
C8  470n  [C0402]  86.4,52 180 bottom
C9  470n  [C0402]  94.2,47.3 0 top
C10  470n  [C0402]  85.5,44.6 270 bottom
C11  4,7u  [C0603]  98.75,15.25 180 bottom
C12  4,7u  [C0603]  98.75,19.95 180 bottom
C13  100u  [C1206]  99.35,16.95 180 bottom
C14  100n  [C0402]  92.4,50.5 0 top
C15  100n  [C0402]  92.4,51.7 0 top
C16  4.7u  [C0603]  92.8,54.8 270 top
C17  100n  [C0402]  92.5,49 0 top
C18  47u  [C0603]  112,42.7 90 bottom
C19  470n  [C0603]  99.54,26.6 0 top
C20  47n  [C0402]  78.6,37.6 90 bottom
C21  47n  [C0402]  79.7,38.6 270 bottom
C22  47n  [C0402]  81.5,38.55 270 bottom
C23  470n  [C0402]  71.07,25.7 270 bottom
C24  470n  [C0402]  87.6,26.6 270 bottom
C25  470n  [C0402]  70.1,25.7 270 bottom
C26  4,7u  [C0603]  92.8,23.2 270 top
C27  4,7u  [C0603]  90.8,23.2 270 top
C28  47u  [C0603]  94.5,22.3 270 top
C29  47n  [C0402]  77.5,38.5 270 bottom
C30  47n  [C0402]  78.6,35.4 270 bottom
C31  470n  [C0402]  68.1,25.3 180 top
C32  4,7u  [C0603]  92.8,22.15 90 bottom
C33  47u  [C0603]  90.8,22.15 90 bottom
C34  47n  [C0402]  80.2,34.8 180 bottom
C35  47n  [C0402]  82.5,37.6 270 bottom
C36  47n  [C0402]  78.6,39.6 270 bottom
C37  470n  [C0402]  71.07,25.1 270 top
C38  470n  [C0402]  70.04,25.1 270 top
C39  470n  [C0402]  85.6,23.6 270 top
C40  4,7u  [C0603]  67.85,25.3 0 bottom
C41  4,7u  [C0603]  94.75,22.15 90 bottom
C42  100u  [C1206]  94.45,18.15 270 bottom
C43  47n  [C0402]  82.3,34.8 180 bottom
C44  470n  [C0402]  89.15,25.2 0 bottom
C45  10n  [C0402]  80.6,37 180 bottom
C46  47n  [C0603]  112.35,96.05 270 top
C47  47n  [C0603]  110.35,96.05 270 top
C48  470n  [C0603]  108.35,96.05 270 top
C49  4,7u  [C0603]  106.35,96.05 270 top
C50  47u  [C0603]  104.35,96.05 270 top
C51  47n  [C0402]  85.1,35 180 bottom
C52  47n  [C0402]  86.7,36.7 0 bottom
C53  47n  [C0402]  83.9,44 270 bottom
C54  470n  [C0402]  86.5,27.1 270 bottom
C55  470n  [C0402]  85.4,27.1 270 bottom
C56  470n  [C0402]  93.9,47.3 180 bottom
C57  4,7u  [C0603]  98.75,18.65 180 bottom
C58  4,7u  [C0603]  98.75,21.25 180 bottom
C59  100u  [C1206]  99.6,20.85 0 top
C60  10n  [C0603]  109.75,15.35 270 bottom
C61  10n  [C0603]  104.7,20 90 top
C62  47n  [C0402]  71.2,30 270 top
C63  47n  [C0402]  78.05,27.35 270 top
C64  47n  [C0402]  71.4,36.5 0 bottom
C65  470n  [C0402]  69.9,29.4 270 top
C66  470n  [C0402]  81.5,40.65 270 bottom
C67  4,7µF  [C0603]  153.67,35.56 90 top
C68  10µF  [C0603]  144.15,34.61 90 top
C69  470n  [C0402]  68.1,27.4 270 top
C70  4,7u  [C0603]  69.47,28.07 180 bottom
C71  4,7u  [C0603]  98.75,13.95 0 bottom
C72  100u  [C1206]  98.15,10.25 0 bottom
C73  47n  [C0402]  71.4,35.5 0 bottom
C74  47n  [C0402]  70.6,47.3 90 bottom
C75  47n  [C0402]  82.4,26.9 270 bottom
C76  470n  [C0402]  68.6,46.6 0 bottom
C77  470n  [C0402]  82.6,26.9 270 top
C78  470n  [C0402]  71.3,38.6 0 bottom
C79  4,7u  [C0603]  66.48,28.07 0 bottom
C80  4,7u  [C0603]  66.48,26.73 0 bottom
C81  100u  [C1206]  98.15,12.35 0 bottom
C82  10n  [C0402]  66.8,81.5 90 top
C83  10n  [C0402]  66.8,87.63 90 top
C84  10n  [C0402]  88.2,50.5 180 bottom
C85  47n  [C0402]  90.8,52.9 180 bottom
C86  47n  [C0402]  91.1,51.7 180 bottom
C87  10n  [C0402]  91.9,50.6 180 bottom
C88  10u  [C0603]  91.3,97.95 180 top
C89  10n  [C0402]  70.9,75.2 90 bottom
C90  10n  [C0402]  70.9,80.7 90 bottom
C91  10u  [C0603]  67.8,94.81 270 top
C92  12p  [C0402]  81.5,6.5 180 bottom
C93  12p  [C0402]  79.3,8.35 90 bottom
C94  100n  [C0402]  82.1,12.6 180 bottom
C95  100n  [C0402]  82.1,11.5 180 bottom
C96  100n  [C0402]  83.8,6 90 bottom
C97  100n  [C0402]  90.25,17.7 0 bottom
C98  10p  [C0402]  91.9,13.15 180 top
C99  100n  [C0402]  90.75,11.05 270 top
C100  100n  [C0402]  83.9,16.4 180 bottom
C101  1u  [C0603]  91.2,16.1 180 top
C102  1u  [C0402]  90.9,16.6 180 bottom
C103  2u2  [C0603]  76.19,8.95 270 top
C104  18p  [C0402]  82.8,7.9 270 top
C105  220pF  [C0603]  140.97,27.3 270 top
C106  220pF  [C0603]  139.38,27.62 270 top
C107  22pF  [C0603]  154.62,20.95 90 top
C108  22pF  [C0603]  149.68,26.09 90 top
C109  22pF  [C0603]  146.9,21.36 270 top
C110  22pF  [C0603]  153.02,24.24 0 top
C111  4,7µF  [C0603]  153.35,31.11 270 top
C112  220pF  [C0603]  134.3,39.05 270 bottom
C113  220pF  [C0603]  135.89,39.37 270 bottom
C114  22pF  [C0603]  120.02,31.75 90 bottom
C115  22pF  [C0603]  128.27,35.24 90 bottom
C116  22pF  [C0603]  131.76,32.7 90 bottom
C117  22pF  [C0603]  123.19,36.2 90 bottom
C118  4,7µF  [C0603]  123.53,42.93 270 bottom
C119  18p  [C0402]  83.9,7.9 270 top
C120  1p  [C0402]  83.9,3.1 270 top
C121  1p  [C0402]  82.2,6.2 180 top
C122  100n  [C0402]  88.1,57.2 90 top
C123  10n  [C0402]  35.37,8.32 0 top
C124  10n  [C0402]  50.67,12.38 90 bottom
C125  10n  [C0402]  52.7,8.32 0 bottom
C126  0,1µF  [C0603]  132.08,23.18 180 top
C127  0,1µF  [C0603]  132.08,24.77 180 top
C128  1µF  [C0603]  129.54,23.5 90 top
C129  33pF  [C0402]  137.08,15.56 90 top
C130  33pF  [C0402]  143.51,23.18 270 top
C131  1µF  [C0603]  122.39,27.27 90 top
C132  1µF  [C0603]  121.92,18.41 270 top
C133  1µF  [C0603]  123.19,18.41 270 top
C134  2,2µF  [C0603]  129.54,20.32 90 top
C135  1µF  [C0603]  120.33,18.41 270 top
C136  1µF  [C0603]  152.72,40.01 0 top
C137  1µF  [C0603]  148.91,40.32 180 top
C138  1µF  [C0603]  125.41,51.75 0 bottom
C139  1µF  [C0603]  128.59,51.75 180 bottom
C142  10µF  [C0603]  156.84,45.09 270 top
C143  10µF  [C0603]  115.89,54.93 270 bottom
C145  22µF  [C0603]  141.6,47.62 90 top
C146  22µF  [C0603]  137.25,55.24 270 bottom
C148  47µF  [C0603]  158.12,34.29 90 top
C149  47µF  [C0603]  118.43,45.4 0 bottom
C151  68µF  [C1206]  137.16,33.97 90 top
C152  68µF  [C1206]  139.38,47.94 90 bottom
C154  4,7µ  [C0603]  122.87,38.42 0 bottom
C156  4,7µ  [C0603]  153.99,26.99 0 top
C157  2,2µF  [C1206K]  152.72,4.13 270 bottom
C158  4,7µF  [C0603]  143.29,31.9 180 top
C159  4,7µF  [C0603]  133.27,43.66 180 bottom
C160  4,7µF  [C0603]  123.54,47.65 90 bottom
C161  10µF  [C0603]  132.08,46.82 90 bottom
C177  10n  [C0603]  69.9,14.2 90 bottom
C178  18p  [C0402]  139.3,88.75 0 bottom
C179  18p  [C0402]  132.2,93.8 270 bottom
C180  1u  [C0603]  126.3,87.6 270 bottom
C181  1n  [C0402]  129.1,87.6 90 bottom
C182  10n  [C0402]  129.1,87.8 90 top
C183  100n  [C0402]  130.2,87.8 90 top
C184  1n  [C0402]  137.65,85.9 180 bottom
C185  10n  [C0402]  137.65,86.9 180 bottom
C186  100n  [C0402]  137.65,86.4 0 top
C187  1n  [C0402]  123.2,75.7 0 bottom
C188  10n  [C0402]  123.2,74.6 0 bottom
C189  100n  [C0402]  123.2,73.5 0 bottom
C190  1u  [C0603]  141.1,67.3 270 top
C191  1n  [C0402]  138.7,74.9 180 bottom
C192  10n  [C0402]  138.7,73.8 180 bottom
C193  100n  [C0402]  138.7,72.7 180 bottom
C194  1n  [C0402]  127.9,87.6 90 bottom
C195  10n  [C0402]  127.9,87.8 90 top
C196  100n  [C0402]  132.5,87.8 90 top
C197  1n  [C0402]  130.3,87.6 90 bottom
C198  10n  [C0402]  131.4,87.8 90 top
C199  100n  [C0402]  127.9,84.7 270 top
C200  1n  [C0402]  127.8,70.6 270 bottom
C201  10n  [C0402]  127.8,70.4 270 top
C202  100n  [C0402]  127.8,73.5 90 top
C203  10u  [C0603]  138.2,67.3 270 top
C204  1n  [C0402]  129.3,70.6 270 bottom
C205  10n  [C0402]  129.3,70.4 270 top
C206  100n  [C0402]  129.3,73.5 90 top
C207  1n  [C0402]  132.75,70.6 270 bottom
C208  10n  [C0402]  132.75,70.4 270 top
C209  100n  [C0402]  132.75,73.5 90 top
C210  1n  [C0402]  138.7,76.4 180 bottom
C211  10n  [C0402]  139.4,76.4 0 top
C212  100n  [C0402]  136.3,76.4 180 top
C213  1n  [C0402]  138.7,80.4 180 bottom
C214  10n  [C0402]  139.3,80.4 0 top
C215  100n  [C0402]  136.2,80.4 180 top
C216  10u  [C0603]  139.7,67.3 270 top
C217  47p  [C0402]  144,82.3 0 bottom
C218  47p  [C0402]  141,83.5 90 bottom
C219  47p  [C0402]  141,76.9 90 bottom
C220  47p  [C0402]  143.3,78.9 90 bottom
C221  47p  [C0402]  129.7,69 0 bottom
C222  47p  [C0402]  133.2,67.7 0 bottom
C223  47p  [C0402]  135.8,67.7 180 bottom
C224  47p  [C0402]  132.2,69 180 bottom
C225  100u  [C1206]  152.6,75.7 180 bottom
C226  100u  [C1206]  152.6,91.7 180 bottom
C227  10n  [C0603]  156.5,85.9 270 bottom
C228  100n  [C0402]  120.2,76.5 0 top
C229  10u  [C0603]  123.8,87.1 180 bottom
C230  47p  [C0402]  92.2,41.6 0 bottom
C231  47p  [C0402]  103.7,41.7 0 bottom
C232  47p  [C0402]  115.5,42.5 90 bottom
C233  10n  [C0402]  91.9,41.6 180 top
C234  10n  [C0402]  105.9,41.7 180 bottom
C235  10n  [C0402]  114.3,42.5 90 bottom
C236  470n  [C0603]  113.15,42.7 90 bottom
C237  470n  [C0603]  109.1,45 90 bottom
C238  470n  [C0603]  103.3,42.85 0 bottom
C239  47p  [C0402]  97.1,41.8 0 top
C240  47p  [C0402]  97.22,27.72 180 top
C241  47p  [C0402]  102.04,27.72 180 top
C242  47p  [C0402]  99.5,42.7 0 bottom
C243  10n  [C0402]  94.4,41.8 180 top
C244  10n  [C0402]  99.35,27.72 0 top
C245  10n  [C0402]  104.15,27.72 0 top
C246  10n  [C0402]  99.5,41.6 0 bottom
C247  470n  [C0402]  97.4,40.6 0 top
C248  470n  [C0603]  104.36,26.6 0 top
C249  470n  [C0603]  99.54,25.5 0 top
C250  47u  [C0603]  104.36,25.5 0 top
C251  10n  [C0603]  73.35,4.95 180 bottom
C252  22p  [C0402]  82.1,13.7 180 bottom
C266  10n  [C0603]  67.37,10.73 0 bottom
C267  10n  [C0603]  28.96,9.72 90 bottom
C268  10n  [C0603]  12.45,9.78 90 bottom
C269  10n  [C0603]  47.41,8.17 180 bottom
C270  10n  [C0603]  82.6,57.3 270 top
D1  WE-TVS_824015  [WE-TVS_SOT23-6L]  104.7,20 180 bottom
D2  WE-TVS_824011  [WE-TVS_SOT23-5L]  112.4,16.15 0 bottom
D3  BAT6202VH6327XTSA1-ND  [SOD523]  91.4,94.2 90 top
D4  WE-TVS_824015  [WE-TVS_SOT23-6L]  70.9,75.2 0 top
D5  WE-TVS_824015  [WE-TVS_SOT23-6L]  66.8,81.5 0 bottom
D6  WE-TVS_824015  [WE-TVS_SOT23-6L]  66.55,9.46 0 top
D7  WE-TVS_824015  [WE-TVS_SOT23-6L]  66.8,87.63 0 bottom
D8  WE-TVS_824011  [WE-TVS_SOT23-5L]  70.9,80.7 0 top
D9  CZSH5-40-TR-ND  [SOT223]  152.72,13.65 180 bottom
D10  WE-TVS_824015  [WE-TVS_SOT23-6L]  35.37,8.32 90 bottom
D11  WE-TVS_824015  [WE-TVS_SOT23-6L]  52.7,13.72 90 top
D12  WE-TVS_824015  [WE-TVS_SOT23-6L]  52.7,8.32 90 top
D35  WE-TVS_824011  [WE-TVS_SOT23-5L]  67.44,14.16 0 bottom
D36  WE-TVS_824011  [WE-TVS_SOT23-5L]  153.6,83.8 0 bottom
D37  BAT6202VH6327XTSA1-ND  [SOD523]  67.09,92.64 0 top
D38  WE-TVS_824015  [WE-TVS_SOT23-6L]  28.96,9.72 0 top
D39  WE-TVS_824015  [WE-TVS_SOT23-6L]  12.45,9.78 0 top
D40  WE-TVS_824015  [WE-TVS_SOT23-6L]  47.41,8.15 270 top
D41  WE-TVS_824015  [WE-TVS_SOT23-6L]  80,56.4 270 top
D42  WE-TVS_824011  [WE-TVS_SOT23-5L]  72.7,4.95 90 top
FRAME1  HTL-A3-HA3H  [HTL-A3-H]  -112.39,-100.33 0 top  (outside the outline)
FRAME2  HTL-A3-HA3H  [HTL-A3-H]  -112.39,-100.33 0 top  (outside the outline)
FRAME3  HTL-A3-HA3H  [HTL-A3-H]  -112.39,-100.33 0 top  (outside the outline)
FRAME4  HTL-A3-HA3H  [HTL-A3-H]  -112.39,-100.33 0 top  (outside the outline)
FRAME5  HTL-A3-HA3H  [HTL-A3-H]  -112.39,-100.33 0 top  (outside the outline)
FRAME6  HTL-A3-HA3H  [HTL-A3-H]  -112.39,-100.33 0 top  (outside the outline)
FRAME7  HTL-A3-HA3H  [HTL-A3-H]  -112.39,-100.33 0 top  (outside the outline)
FRAME8  HTL-A3-HA3H  [HTL-A3-H]  -112.39,-100.33 0 top  (outside the outline)
FRAME9  HTL-A3-HA3H  [HTL-A3-H]  -112.39,-100.33 0 top  (outside the outline)
FRAME10  HTL-A3-HA3H  [HTL-A3-H]  -112.39,-100.33 0 top  (outside the outline)
G1  10MM_SM_COIN_CELL_CLIP  [10MM_SM_COIN_CELL_CLIP]  79.6,93.5 180 bottom
IC1  S25FL128P  [S25FL128P]  84,59.6 0 bottom
IC5  FT240X  [SSOP24-0.635-8.65X4MM]  87,50.9 270 top
IC6  CC2540  [QFN40-6X6]  87.7,12.4 0 bottom
IC7  Arietta/FPGA  [LT8602]  148.91,33.02 270 top
IC8  Boards  [LT8602]  127.64,45.09 270 bottom
IC9  TUSB4041I  [HTQFP-64-EXP]  131,78.7 180 bottom
IC10  LTC2947  [LTC2947]  124.14,22.54 180 top
IC11  74AHC1G32DCK  [SC70-5]  71.25,15.55 90 top
IC12  74AHC1G04DCK  [SC70-5]  73.95,12.6 90 top
IC13  74AHC1G04DCK  [SC70-5]  73.95,14.9 90 top
IC14  EEPROM  [SOIC-8]  121.44,72.24 0 top
IC16  MT48LC16M16A2  [TSOP54-400]  105.1,34.8 180 bottom
K1  61001221121  [61001221121]  111.8,16.9 90 top
K2  61000418221  [61000418221]  84.3,62.1 180 top
K3  691321100002  [691321100002]  156.21,6.99 90 top
K4  61300511821  [61300511821]  147.32,8.89 270 top
K5  61300511821  [61300511821]  121.92,9.21 270 top
L1  1u  [L2012C]  90.5,25.7 0 top
L2  1u  [L2012C]  81.2,35.9 180 bottom
L3  6n8  [L2012C]  82.5,15 180 bottom
L4  220 Ohm @ 100 Mhz  [WE-KI_0603_B]  76.2,9.4 90 bottom
L5  4,3n  [WE-KI_0402A]  82.8,3.1 0 top
L6  4,3n  [WE-KI_0402A]  84.3,6.2 90 top
L7  220 Ohm @ 100 Mhz  [WE-KI_0603_B]  144.1,65.7 90 top
L8  12n  [WE-KI_0402A]  83.4,4.9 90 top
L10  220 Ohm @ 100 Mhz  [WE-KI_0603_B]  142.55,64.35 90 top
L13  10µH  [NR6028T100M]  152.72,44.45 90 top
L14  4,7µH  [NR6028T100M]  146.05,44.45 90 top
L15  2,2µH  [IHHP-0806AZ-01]  155.26,33.02 0 top
L16  1,1µH  [SRN3012TA]  140.02,31.43 180 top
L17  10µH  [NR6028T100M]  125.09,56.2 90 bottom
L18  4,7µH  [NR6028T100M]  131.76,56.2 90 bottom
L21  2,2µH  [IHHP-0806AZ-01]  121.3,45.07 0 bottom
L24  1,1µH  [SRN3012TA]  136.53,43.81 180 bottom
LED_BANK1_FAULT  0.7  [SMARTLED-TTW]  105.3,1.8 180 top
LED_BANK1_ONLINE  0.7  [SMARTLED-TTW]  108.8,1.8 180 top
LED_BANK2_FAULT  0.7  [SMARTLED-TTW]  101.4,1.8 180 top
LED_BANK2_ONLINE  0.7  [SMARTLED-TTW]  112.2,1.8 180 top
LED_BLUETOOTH  0.7  [SMARTLED-TTW]  115.8,1.8 180 top
LED_DONE  0.7  [SMARTLED-TTW]  97.4,1.8 180 top
PAD1  [SMD1,27-2,54]  158.43,47.94 180 top
PAD2  [SMD1,27-2,54]  158.43,41.59 0 top
PAD3  [SMD1,27-2,54]  141.92,41.59 0 top
PAD4  [SMD1,27-2,54]  147.29,52.91 90 top
PAD5  [SMD1,27-2,54]  158.12,26.35 180 top
PAD6  [SMD1,27-2,54]  157.48,32.38 0 top
PAD7  [SMD1,27-2,54]  134.14,28.7 90 top
PAD8  [SMD1,27-2,54]  137.16,31.43 180 top
PAD9  [SMD1,27-2,54]  117.79,52.39 90 bottom
PAD10  [SMD1,27-2,54]  126.65,59.9 90 bottom
PAD11  [SMD1,27-2,54]  131.25,60.49 90 bottom
PAD12  [SMD1,27-2,54]  136.53,53.02 270 bottom
PAD13  [SMD1,27-2,54]  118.09,41.48 270 bottom
PAD14  [SMD1,27-2,54]  118.25,43.96 90 bottom
PAD15  [SMD1,27-2,54]  140.56,39.42 0 bottom
PAD16  [SMD1,27-2,54]  137.85,46.44 90 bottom
Q1  SPD30P06PTO252  [TO252]  127,9.53 0 bottom
Q2  24MHz  [CTS406]  134.18,89.94 0 bottom
Q3  32MHz  [CTS402_3.2X2.5]  81.85,8.68 0 bottom
R1  33  [R0402]  92.1,29.3 0 top
R2  0  [R0402]  106.5,15.55 90 top
R3  4k7  [R0402]  79.6,16.5 0 top
R4  1k  [R0402]  78.2,53.1 90 top
R5  1k  [R0402]  81.02,53.15 270 top
R6  1k  [R0402]  77.2,57.7 90 top
R7  200  [R0402]  90.1,55.7 270 bottom
R8  100  [R0402]  81.2,11.6 0 top
R9  4k7  [R0402]  103.9,45.8 0 bottom
R10  4k7  [R0402]  90.1,58.7 90 bottom
R11  100  [R0402]  80.5,47.7 270 bottom
R12  100  [R0402]  81.2,48.1 90 top
R13  100  [R0402]  81.6,50.2 90 bottom
R14  1k  [R0402]  76.1,57.7 270 top
R15  4k7  [R0402]  81.47,51.4 0 top
R16  100  [R0402]  82.7,47.7 270 bottom
R17  330  [R0402]  103.2,60.75 90 bottom
R18  100  [R0402]  93.1,66.5 0 bottom
R19  100  [R0402]  92.2,46.2 180 top
R20  33  [R0402]  92,40.5 180 bottom
R21  0  [R0402]  92,25.6 180 bottom
R22  330  [R0402]  92.4,55 180 bottom
R23  330  [R0402]  92.1,59.4 180 bottom
R24  330  [R0402]  92.2,63.3 270 bottom
R25  33  [R0402]  121.8,84.2 90 top
R26  10Ohm  [R0603]  158.43,45.09 90 top
R27  10Ohm  [R0603]  141.6,44.45 90 top
R28  10Ohm  [R0603]  158.12,29.53 90 top
R29  10Ohm  [R0603]  135.89,29.53 90 top
R30  10Ohm  [R0603]  117.79,54.93 90 bottom
R31  10Ohm  [R0603]  135.81,55.24 90 bottom
R32  10Ohm  [R0603]  120.33,42.86 90 bottom
R33  10Ohm  [R0603]  140.97,41.91 90 bottom
R34  100  [R0402]  80.7,14.3 90 top
R35  100  [R0402]  79.2,14.3 90 top
R36  1  [R0402]  92.91,96.92 0 bottom
R37  10k  [R0603]  93.1,94.5 90 top
R38  10k  [R0603]  66.95,91.15 0 top
R39  56k  [R0603]  78.7,14.7 0 bottom
R40  100  [R0402]  84.2,19.7 180 top
R41  100  [R0402]  76.9,12.59 180 top
R42  100  [R0402]  76.9,11.39 180 top
R43  1M  [R0805]  133.5,86.5 0 bottom
R44  9k53 1%  [R0603]  139.1,84.4 0 bottom
R45  90k9 1%  [R0603]  122.9,84.5 270 bottom
R46  10k 1%  [R0603]  124.7,84.5 270 bottom
R47  27  [R0402]  139.1,81.6 0 bottom
R48  27  [R0402]  139.1,77.6 0 bottom
R49  27  [R0402]  139.1,78.8 0 bottom
R50  27  [R0402]  139.1,82.8 0 bottom
R51  27  [R0402]  133.9,70.6 90 bottom
R52  27  [R0402]  130.4,70.6 90 bottom
R53  27  [R0402]  135.1,70.6 90 bottom
R54  27  [R0402]  131.5,70.6 90 bottom
R55  25  [R0402]  92.2,40.5 0 top
R56  1k  [R0402]  123.98,78.91 270 bottom
R57  1k  [R0603]  123.1,81 0 bottom
R58  1k  [R0402]  116.4,89.5 270 top
R61  0  [R0402]  116.4,92 90 top
R62  1  [R0402]  68.3,16.2 180 top
R63  1k5  [R0402]  135.2,66 90 bottom
R64  1k5  [R0402]  131.55,67.3 270 bottom
R65  10k  [R0402]  105.9,42.9 0 bottom
R84  68k  [R0603]  153.99,28.57 180 top
R85  400k  [R0603]  143.83,26.67 270 top
R86  100k  [R0603]  142.3,27.09 90 top
R87  715k  [R0603]  156.53,21.91 0 top
R88  180k  [R0603]  153.35,20.95 90 top
R89  412k  [R0603]  147.06,25.98 270 top
R90  180k  [R0603]  148.38,26.06 90 top
R91  47k  [R0603]  148.16,21.36 90 top
R92  180k  [R0603]  149.43,21.36 270 top
R93  226k  [R0603]  155.89,25.4 0 top
R94  180k  [R0603]  156.53,23.81 180 top
R95  10k  [R0603]  137.79,27.62 90 top
R96  68k  [R0603]  122.87,39.69 180 bottom
R97  400k  [R0603]  131.13,38.73 270 bottom
R98  100k  [R0603]  132.72,38.73 90 bottom
R99  715k  [R0603]  121.6,31.75 270 bottom
R100  180k  [R0603]  123.19,31.75 90 bottom
R101  412k  [R0603]  126.68,35.24 270 bottom
R102  180k  [R0603]  125.09,35.24 90 bottom
R103  68k  [R0603]  130.18,32.7 270 bottom
R104  180k  [R0603]  131.76,35.24 0 bottom
R105  226k  [R0603]  121.6,36.2 270 bottom
R106  180k  [R0603]  120.02,36.2 90 bottom
R107  10k  [R0603]  137.48,39.37 90 bottom
R120  22Ohm  [R0603]  132.08,19.37 0 top
R121  22Ohm  [R0603]  132.08,21.27 0 top
R122  100k  [R1206]  140.34,20 180 bottom
R123  2Ohm  [R1206]  150.18,7.3 90 bottom
R124  4,02k  [R1206]  143.19,22.86 180 bottom
R125  4,02k  [R1206]  140.34,17.14 0 bottom
R126  10m  [R1206]  131.76,17.14 180 top
RN1  100  [EXBV8V]  92,75.9 90 top
RN2  100  [EXBV8V]  92,84.3 270 bottom
RN3  100  [EXBV8V]  67.5,33.9 90 top
RN4  100  [EXBV8V]  67.5,30.5 90 top
RN5  100  [EXBV8V]  67.7,33.9 270 bottom
RN6  100  [EXBV8V]  73.2,23 180 top
RN7  100  [EXBV8V]  73.2,23.2 180 bottom
RN8  100  [EXBV8V]  76.6,23 180 top
RN9  100  [EXBV8V]  67.7,30.5 270 bottom
RN10  100  [EXBV8V]  76.6,23.2 180 bottom
RN11  100  [EXBV8V]  80,23.2 180 bottom
RN12  100  [EXBV8V]  80,23 180 top
RN15  10k  [EXBV8V]  104.4,45.8 270 top
RN16  100  [EXBV8V]  92,87.9 270 bottom
RN17  100  [EXBV8V]  92,80.05 270 top
RN18  100  [EXBV8V]  86,6.5 180 bottom
RN19  100  [EXBV8V]  89.4,6.5 180 bottom
RN20  100  [EXBV8V]  92.9,6.5 180 bottom
RN21  33  [EXBV8V]  83.4,23 0 top
RN22  33  [EXBV8V]  83.4,23.2 0 bottom
RN23  100  [EXBV8V]  67.5,37.3 90 top
RN24  100  [EXBV8V]  71.4,50.6 0 top
RN25  100  [EXBV8V]  67.7,37.3 270 bottom
RN26  100  [EXBV8V]  67.7,44.1 270 bottom
RN27  100  [EXBV8V]  67.5,44.1 90 top
RN28  100  [EXBV8V]  67.5,40.7 90 top
RN29  100  [EXBV8V]  67.8,40.7 270 bottom
RN30  100  [EXBV8V]  67.5,47.5 90 top
RN31  100  [EXBV8V]  74.8,50.4 0 bottom
RN32  100  [EXBV8V]  74.8,50.6 0 top
RN33  100  [EXBV8V]  71.4,50.4 0 bottom
RN34  100  [EXBV8V]  78.2,50.4 0 bottom
RN35  1k  [EXBV8V]  125.5,71.9 270 top
RN36  33  [EXBV8V]  92.3,43.8 90 top
RN37  33  [EXBV8V]  92,34.9 270 bottom
RN38  33  [EXBV8V]  92,27.9 270 bottom
RN39  33  [EXBV8V]  92,31.5 270 bottom
RN40  33  [EXBV8V]  92.1,43.8 270 bottom
RN41  33  [EXBV8V]  92.2,38.3 90 top
RN42  33  [EXBV8V]  92.2,34.9 90 top
RN43  33  [EXBV8V]  92.1,31.5 90 top
RN44  25  [EXBV8V]  92,38.3 270 bottom
S1  TASTER_SMD  [TASTER_SMD]  79.8,90 90 top
S2  TASTER_SMD  [TASTER_SMD]  87.1,90 270 top
S3  TASTER_SMD  [TASTER_SMD]  72.5,90 90 top
TP3  PTR1TP06SQ  [TP06SQ]  85.2,10.8 0 top
TP4  PTR1TP06SQ  [TP06SQ]  84.2,10.8 0 top
U1  XC7A100TFTG256  [FT256]  81.2,37.5 90 top
U$1  ARIETTA  [ARIETTA]  108.6,72.8 0 top
U$4  NTD4969NT4G_N-MOS  [TO252]  142.24,9.53 0 bottom
U$5  ASE  [ASE]  86.7,48.3 270 bottom
U$6  ASE  [ASE]  89.6,48.3 270 bottom
U$7  NUF2221W1  [NUF2221W1]  142.8,76.7 270 top
U$8  NUF2221W1  [NUF2221W1]  142.8,83.7 90 top
U$9  MF-SMDF200  [MF-SMDF050]  154.31,20.64 0 bottom
U$10  MF-SMDF200  [MF-SMDF050]  156.21,66.92 90 bottom
U$11  NTD4969NT4G_N-MOS  [TO252]  134.62,9.53 0 bottom
X1  FAB64S  [FAB64S]  60.33,49.53 0 top
X2  FAB64S  [FAB64S]  41.27,49.53 0 top
X3  FAB64S  [FAB64S]  22.86,49.53 0 top
X4  FAB64S  [FAB64S]  6.35,49.53 0 top
X5  ABLS2-4.000MHZ-D4Y-T  [ABLS2-4.000MHZ-D4Y-T]  140.34,17.46 90 top
X6  [USB-A003]  160.35,72.19 90 top
X7  [USB-A003]  160.35,88.18 90 top
X8  [JMP2]  72.75,8.75 270 top

## Tracks (layer width: path | path; a pad name or v marks a point on that pad's centre or on a via)
$N299  (via drill 0.8)
  Signal_Top 0.305: 146.37,75.7 X6.4 | 146.38,91.7 X7.4
  Signal_Top 0.406: 145.2,75.69 145.2,76.1
  Signal_Top 0.6: v149.3,75.7 146.37,75.7 | X6.4 145.2,75.69 | 145.2,76.1 145.18,76.1
  Signal_Top 1.016: v149.2,91.7 146.38,91.7
  Signal_Bottom 0.305: 151.3,75.8 C225.1 | 152.6,85.1 D36.4
  Signal_Bottom 1.016: C225.1 v149.3,75.7 | C226.1 v149.2,91.7
  pour Signal_Bottom (isolate 0.15, no thermals): 158.4,68.8 155.9,68.8 155.9,77.95 152.55,81.3 152.1,81.3 152.1,74.55 148.55,74.55 148.55,76.6 151.15,76.6 151.15,83 152.9,83 152.9,82.1 153.5,81.5 155.25,81.5 155.25,84.6 150.3,84.6 150.3,90.85 148.35,90.85 148.35,92.65 152.05,92.65 152.05,85.8 158.4,85.8
+1V1_EXT  (via drill 0.3, 0.6)
  Signal_Top 0.254: v137.52,41.48 137.52,41.07 137.95,40.64 140.02,40.64 140.34,40.32 140.34,38.42 138.76,36.55 138.76,34.72 v138.16,34.11
  VCC 0.254: v131.76,30.48 132.72,29.83 138.45,29.83 138.81,30.24 138.81,32.05 138.2,32.66 138.2,34.07 v138.16,34.11
  Signal_Bottom 0.254: C152.1 138.43,45.4 137.57,44.55 L24.P$2 138.01,43.81 | C116.1 v131.76,30.48 | v137.52,41.48 137.91,41.48 138.11,41.27 137.48,41.27
  Signal_Bottom 0.406: 136.02,48.01 136.59,48.01
  Signal_Bottom 0.61: L24.P$2 137.57,42.13 138.11,41.59 138.11,41.27 138.43,41.27 138.75,40.96 139.38,40.96 139.7,41.27 139.7,42.55 140.75,42.55 R33.2 | C152.1 138.88,46.54 138.43,46.99 138.43,47.62 137.79,47.62 v137.48,47.62 136.41,47.62 | 136.84,45.72 136.84,44.77 | 137.79,47.31 136.21,47.62 136.84,46.99 140.34,46.99 140.34,42.86 139.38,42.86 139.38,41.59 v139.06,41.55 138.11,42.23 136.84,42.23 136.84,44.77 | 136.84,44.77 137.79,45.72 137.16,46.35 137.48,46.67 136.84,46.67 136.53,46.35 136.53,47.31
  Signal_Bottom 0.813: 138.11,47.31 137.79,47.31 137.26,46.95 136.84,46.67 136.21,46.35 | 136.21,46.35 137.16,45.72 138.11,46.67 138.11,45.72 137.79,45.72 137.48,45.4 139.7,45.4 140.02,45.72 140.02,43.5 139.7,43.18 139.7,42.86 138.75,41.91 138.11,42.55 138.11,44.77 139.38,44.77 139.38,43.18 138.75,42.55 138.75,44.45 | 136.84,45.72 136.21,46.35 | 136.21,46.35 136.03,46.04 136.02,46.02 136.02,48.01 137.41,48.01 137.79,47.62
  other vias: 139.06,42.55 139.06,43.81 139.06,45.09
  pour VCC (no thermals): 140.65,48.3 136.75,48.3 136.75,45.75 138,45.75 138,42.05 137.25,42.05 137.25,40.84 140.65,40.84
  pour Signal_Top (isolate 0.2, rank 2, no thermals): 136.8,47.15 138.4,47.15 140.95,49.7 140.95,51.9 145.25,56.2 145.25,65.3 143.7,65.3 143.7,57.15 139.3,53 139.3,50.55 136.8,48.05
  pour Signal_Bottom (isolate 0.2, rank 2, no thermals): 135.7,48.3 137.75,48.3 138.15,47.9 140.65,47.9 140.65,43.35 141.5,43.35 141.55,43.3 141.55,42.2 139.95,42.2 139.95,40.7 138.5,40.7 138.1,41.1 137.25,41.1 137.25,41.85 136.65,41.85 136.65,45.6 135.65,45.6 135.65,48.3
+1V1_HUB  (via drill 0.3)
  Signal_Top 0.6: C201.1 v127.8,72.05 C202.1 | C205.1 v129.3,72.06 C206.1 | C208.1 v132.75,72.04 C209.1 | C211.1 v137.6,76.4 C212.1 | C214.1 v137.6,80.4 C215.1
  Signal_Bottom 0.305: IC9.25 v131.25,86.25 131.25,86.6 130.9,86.95 C197.1 | C200.1 v127.8,72.05 127.75,71.95 IC9.63 | C204.1 v129.3,72.06 129.25,72.25 IC9.60 | IC9.53 v132.75,72.04 C207.1 | C210.1 v137.6,76.4 137.55,76.45 IC9.45 | C213.1 v137.6,80.4 137.55,80.45 IC9.37 | 127.7,86.95 C194.1 127.9,86.55 v128.2,86.25 | v128.2,86.25 128.15,86.25 | IC9.19 128.25,86.2 v128.2,86.25
  other vias: 137.95,69.35 138.55,69.35 139.15,69.35 139.75,69.35 139.75,69.95 139.15,69.95 138.55,69.95 137.95,69.95 137.95,70.55 138.55,70.55 139.15,70.55 139.75,70.55
  pour VCC (isolate 0.2, no thermals): 140.2,68.3 140.2,94.8 125,94.8 125,75.3 126,75.3 126,73 125.1,73 125.1,68.3
  pour Signal_Top (isolate 0.2, rank 2, no thermals): 143.6,66.05 143.6,67.1 142.75,67.95 142.75,69.75 142.1,70.4 140.5,70.4 140.25,70.15 140.25,67.7 137.8,67.7 137.8,71.8 143.85,71.8 144.45,71.2 144.45,66.05
  pour VCC (isolate 0.2, no thermals): 140.2,68.3 140.2,94.8 125,94.8 125,75.3 126,75.3 126,73 125.1,73 125.1,68.3
  pour Signal_Top (isolate 0.15, rank 2, no thermals): 127.55,87.35 132.85,87.35 132.85,85.1 127.55,85.1
+1V8_EXT  (via drill 0.3, 0.4)
  Signal_Top 0.279: X2.B32 42.55,10.05
  Signal_Top 0.61: 11.5,0.95 v11.49,0.76 | 42.55,9.45 X2.B32 | D6.1 65.55,8.16
  Signal_Top 0.7: D39.1 9.23,8.55 X4.B32 | D38.1 25.82,8.47 X3.B32 | D40.3 44.8,7.2 42.55,9.45 | D6.1 63.54,8.21 X1.B32 | 28.01,0.99 v28,0.77
  Signal_Top 0.8: D39.1 11.5,0.95 | D38.1 28.01,0.99 | v46.15,0.75 D40.3 | 65.55,8.16 v65.55,0.75
  VCC 0.254: v118.1,36.2 115.8,36.2
  Signal_Bottom 0.254: 123.19,35.4 123.19,35.61 122.6,36.2 v118.1,36.2
  Signal_Bottom 0.305: L21.P$2 120.31,45.38 120.33,45.4 | C117.1 123.19,35.4
  other vias: 117.25,42.98 117.9,42.98 118.55,42.98 119.2,42.98
  pour VCC (no thermals): 119.38,44.78 115.08,44.78 115.08,1.4 10.87,1.4 10.87,0.3 116.6,0.3 116.6,42.55 119.38,42.55
  pour Signal_Top (isolate 0.2, no thermals): 60.55,11 62.25,11 62.25,10.1 63.7,8.65 65.85,8.65 65.85,7.95 60.55,7.95
  pour Signal_Top (isolate 0.2, no thermals): 45.1,7.95 43.55,9.6 43.5,11.05 41.75,11.05 41.75,9.5 44.3,6.95 46.6,6.95 46.6,7.7
  pour Signal_Top (isolate 0.2, rank 2, no thermals): 28.35,8.25 24.65,8.25 23.25,9.65 23.25,11.6 24.57,11.6 27.02,9.15 28.35,9.15
  pour Signal_Top (isolate 0.2, rank 2, no thermals): 11.8,9.05 10.55,9.05 7.95,11.6 6.7,11.6 6.7,9.3 7.75,9.3 8.85,8.1 11.8,8.1
  pour Signal_Top (isolate 0.2, rank 2, no thermals): 11.1,8.75 11.1,0.5 11.9,0.5 11.9,8.75
  pour Signal_Top (isolate 0.2, rank 2, no thermals): 27.6,0.5 28.45,0.5 28.45,8.6 27.55,8.6 27.55,0.5
  pour Signal_Top (isolate 0.2, no thermals): 45.7,0.5 45.7,7.5 46.6,7.5 46.6,0.5
  pour Signal_Top (isolate 0.2, rank 2, no thermals): 65.1,0.5 65.15,8.15 65.95,8.15 66,0.5
  pour Signal_Bottom (isolate 0.2, no thermals): 116.95,42.55 119.45,42.55 119.45,43.35 120.8,43.35 120.8,45.75 118.8,45.75 118.8,44.55 116.95,44.55
+1V8_INT  (via drill 0.2, 0.3, 0.6)
  Signal_Top 0.254: C110.1 152.14,24.24 151.4,23.5 v150.9,23.5
  Signal_Top 0.279: C27.1 91.05,24.05 | 92.82,24.03 C26.1 | v91.81,24.04 91.71,24.04 91.7,24.05
  Signal_Top 0.305: 158.12,30.16 R28.2 | C148.1 158.12,33.66
  Signal_Top 0.406: L15.P$2 155.93,33.62 155.89,33.66 158.12,33.66 158.75,33.66 158.75,29.84 155.89,29.84 155.89,33.02 156.21,33.34
  Signal_Top 0.61: C27.1 91.7,24.05 C26.1 | 91.05,24.05 91.5,24.5 L1.2 91.5,26.3 91.1,26.7 89.1,26.7 v88.8,27 | 92.82,24.03 v93.82,24.03 94.5,23.35 C28.1
  Signal_Top 1.016: 156.21,33.34 158.12,33.34 158.43,33.02 158.43,30.48 158.12,30.16 156.53,30.16 v156.62,30.33 156.21,30.48 156.21,32.7 157.8,32.7 158.12,32.38 158.12,31.11 157.8,30.8 157.16,30.8 156.84,31.11 156.84,32.07 157.16,32.07 PAD6.1
  VCC 0.279: 82.8,39.9 82.8,40 U1.K11 82.8,39.9 | 82.8,39.9 82.6,39.9 | U1.G10 79.8,39
  VCC 0.3: v150.9,23.5 150.9,22.6 149.8,21.5 | 86.2,29.2 86.2,29.15 86.2,28.95 | 86.2,29.2 85.6,29.2 85.2,29.6 85.2,35.35 85.45,35.6 85.45,35.7 85.35,35.8 | 85.2,35.65 85.35,35.8 | 85.35,35.8 85.5,35.95 | 86.2,29.2 86.2,34.7
  VCC 0.305: 86.2,34.7 85.5,35.4 85.5,35.95 85.5,37.2 U1.L10 83.6,39 83.6,39.1 82.8,39.9 | 82.6,39.9 U1.J10 81.2,38.5 80.3,38.5 79.8,39 | U1.G10 78.7,38 U1.F8
  VCC 0.6: v87.45,27.7 87.45,27.9 86.2,29.15
  FastSignal_Bottom 0.305: 87.4,27.8 v87.45,27.7
  FastSignal_Bottom 0.406: 83.5,27.7 83.55,27.7
  FastSignal_Bottom 0.61: v87.45,27.7 83.55,27.7 82.95,27.1 v71.2,27.1
  Signal_Bottom 0.279: U1.G10 C21.1 | U1.F8 78.65,37.1 C20.1 | C22.1 U1.J10 | 88,27 87.85,27.1 | 87.6,27.6 v87.45,27.7 87.6,27.55
  Signal_Bottom 0.61: v88.8,27 88,27 | 87.85,27.1 C24.1 87.6,27.55 | C25.1 v70.1,27.1 v71.2,27.1 C23.1
  other vias: 156.62,31.5 81.7,39 79.7,39 78.7,37 83.7,39 82.7,40 109,7.8 110,7.8 117.6,7.8 118.7,7.8 157.8,31.5 108,7.8 107,7.8 117.6,6.75 118.7,6.75
  pour VCC (isolate 0.3, no thermals): 156.18,32.7 159.04,32.7 159.07,29.53 159.07,16.3 145,16.3 145,0.2 117.25,0.2 117.25,8.4 131.4,8.4 131.4,20.4 131.39,21.44 131.39,22.51 131.63,22.52 145.41,22.52 145.41,21.91 150.18,21.91 150.18,17.94 157,17.94 157,29.53 156.18,29.53
  pour VCC (no thermals): 106.25,10.2 106.25,7.8 95.77,7.8 95.77,24.85 89.65,24.85 89.65,21.5 94.25,21.5 94.25,6.18 110.4,6.18 110.4,10.2
  pour VCC (rank 4, no thermals): 78.7,38.9 78.7,37 79.5,37 79.5,38.5 81.3,38.5 81.3,38.9 83.6,38.9 83.6,37.9 84.8,37.9 84.8,35.6 85.6,35.6 85.6,38.3 84.5,38.3 84.5,40 80,40 80,38.9
  pour Signal_Bottom (isolate 0.2, no thermals): 119.1,8.2 106.4,8.2 106.4,6.35 119.05,6.35 119.1,6.35
  pour Signal_Top (isolate 0.15, no thermals): 95,22.7 94.1,22.7 94.1,23.5 90.3,23.5 90.3,24.6 90.8,24.6 90.8,26.4 90.8,26.5 88.5,26.5 88.5,27.3 92.1,27.3 92.1,24.6 95,24.6
+1V_INT  (via drill 0.2, 0.3, 0.6)
  Signal_Top 0.279: 81.7,34.9 U1.J6 | 78.8,40 U1.F11 | U1.F9 U1.E10 | v85.6,25 C39.1 | 69,25.55 C31.1 | 69,26.1 v69.05,26.15
  Signal_Top 0.305: v134.14,31.81 134.05,31.81 133.86,32.01 | C109.1 146.7,22.52 v146.1,22.51
  Signal_Top 0.61: 69,26.1 69,25.55 69.9,25.55 C38.1 C37.1
  Signal_Top 1.016: L16.P$2 138.97,30.69 138.61,30.33 133.87,30.33 133.87,30.35 133.86,32.01 133.84,33.45 137.36,33.45 138.43,32.38 138.43,31.11 138.11,30.8 133.99,30.8 133.99,31.75 | 133.99,31.75 133.99,32.7 136.84,32.7 | 136.84,32.7 137.79,31.75 137.48,31.75 | 137.48,31.75 134.43,31.75 | 133.99,31.75 134.43,31.75 | 134.43,31.75 C151.1 | PAD8.1 137.48,31.75 | R29.2 136.42,33.12 136.84,32.7
  VCC 0.279: 80.7,38.1 U1.H9 80.7,37.9 | U1.L8 83.8,37 | C30.1 78.65,36.05 U1.F7 | 79.7,34.8 U1.G6 79.7,35.1 | 82,34.45 82,34.7 U1.J6
  VCC 0.3: 118.69,26.52 118.43,26.25 118.43,25.08 118.76,24.75 120.75,24.75 121.55,23.95 134.85,23.95 | 80.2,32.5 79.35,32.5 79.2,32.65 79.2,34.45 C34.1 | 80.2,32.8 80.2,34.65 | 84.8,25.15 83.2,26.75 83.2,34.2 82.95,34.45 82,34.45
  VCC 0.305: 79.2,40.5 U1.F11 U1.E10 78.2,38.5 78.2,36.45 C30.1 | 79.7,35.1 80.1,35.5 81.2,35.5 U1.J6 | U1.L8 U1.K9 82.2,37.5 81.1,37.5 80.7,37.9 80.3,37.5 80.3,36.6 80.2,36.5 79.2,36.5 U1.F7 U1.G6 80.2,34.5 | 84.8,25.15 84.95,25 v85.6,25 | v146.1,22.51 145.04,22.51 143.6,23.95 134.85,23.95
  VCC 0.6: v69.05,26.15 75.95,26.15 78.2,28.4 79.8,28.4 80.75,29.35 80.75,31.95 80.2,32.5
  FastSignal_Bottom 0.61: v88.9,24.2 86.4,24.2 v85.6,25 82.75,25 82.25,24.5 70.7,24.5 v69.05,26.15
  Signal_Bottom 0.279: U1.E10 77.75,39 C29.1 | U1.F7 78.69,36.03 C30.1 | U1.J6 C43.1 | U1.G6 79.4,34.95 C34.1 | U1.K9 C35.1 | C36.1 78.6,40.1 U1.F11 | v69.05,26.15 69,25.6 C40.1
  Signal_Bottom 0.61: v88.9,24.2 89.5,23.6 89.5,21.75 89.95,21.3 C33.1 C32.1 C41.1 94.75,19.2 | v96.6,19.2 94.75,19.2 | 94.75,19.2 C42.1
  other vias: 137.64,30.61 134.14,30.54 135.48,31.66 135.48,33.25 134.14,33.08 77.7,39 78.7,36 81.7,35 79.7,35 82.7,38 78.7,40 80.7,38 83.7,37 104.9,8.8 103.8,8.8 117.6,9.3 118.7,9.3 103.8,9.85 104.9,9.85 117.6,10.35 118.7,10.35
  pour VCC (isolate 0.12, rank 2, no thermals): 138.59,29.84 133.35,29.84 133.35,31.4 124.3,31.4 124.31,31.39 122.65,31.39 122.65,26.7 119.3,26.7 119.3,8.8 117.19,8.8 117.19,31.32 117.2,33.97 137.62,33.97 137.79,33.94 137.79,31.75 138.59,31.75
  pour VCC (no thermals): 105.75,8.2 96.2,8.2 96.2,19.55 98.5,19.55 98.5,10.2 105.75,10.2
  pour VCC (rank 2, no thermals): 82.8,34.4 77.6,34.4 77.6,40.95 82.7,40.95 82.7,40.4 79.6,40.4 79.6,39.3 78.3,39.3 78.3,36.6 79.9,36.6 79.9,38.5 83.2,38.5 83.2,38 83.9,38 83.9,37.4 84.4,37.4 84.4,35.6 82.8,35.6
  pour Signal_Bottom (isolate 0.2, no thermals): 96.85,19.5 95.3,19.5 95.3,21.65 94.45,21.65 90,21.65 89.85,21.8 89.85,23.75 89.2,24.4 88.65,24.4 88.65,24.15 89.2,23.6 89.2,21.7 90,20.9 93.5,20.9 93.5,18.85 96.9,18.85 96.9,19.5
  pour Signal_Bottom (isolate 0.2, rank 2, no thermals): 103.35,10.25 103.35,8.4 119.05,8.4 119.05,10.7 103.35,10.7
+3V3_ARIETTA  (via drill 0.4)
  Signal_Top 0.279: RN15.7 105.4,46.2 | v66.8,83.66 | 70.1,82.1 D8.5 | v70.89,82.1 v70.9,82.11 | v70.9,77.36
  Signal_Top 0.61: v66.8,89.81 C83.2 | C82.2 v66.8,83.66 | 70.1,82.1 v70.89,82.1 | D4.5 v70.9,77.36 | v91.4,92.76 D3.C 93.05,93.6 R37.1 v93.1,92.76
  Signal_Top 0.813: U$1.5 101.2,91.85 102.5,90.55 102.5,74.85 103.25,74.1 103.25,49.55 105.2,47.6 105.2,47.02 RN15.8 RN15.7 RN15.6 RN15.5
  Signal_Bottom 0.279: v66.8,83.66 | v70.9,82.11 | C89.2
  Signal_Bottom 0.61: D7.5 v66.8,89.81 | D5.5 v66.8,83.66 | C90.2 v70.9,82.11 | v70.9,77.36 C89.2
  pour VCC (isolate 0.2, no thermals): 101.9,95.2 101.9,89.35 93.55,89.35 93.55,76.85 66.45,76.85 66.45,90.4 66.85,90.4 66.85,99.5 98.1,99.5 98.1,95.2
+3V3_BLUETOOTH  (via drill 0.2, 0.3, 0.4)  (1 unrouted)
  Signal_Top 0.254: 91.11,13.14 C98.2
  Signal_Top 0.275: v90.73,9.74 90.73,10.58 C99.2
  Signal_Top 0.279: C98.2 91.15,13.15
  Signal_Top 0.406: 76.23,9.85 C103.1 76.43,10.05 | v89.45,16.4 90.05,16.4 C101.2 | v90.21,13.16 C98.2
  Signal_Top 0.61: D12.5 v50.37,8.32 | D11.5 51.17,13.72 v50.77,13.52 | C123.2 v38.39,8.32 | v77.3,10.05 L4.2
  VCC 0.61: 50.71,8.32 v50.37,8.32 51.12,8.32 51.4,8.6 51.4,11.4 | v38.39,8.32 38.39,10.69 39.1,11.4 50.8,11.4 | v56.9,11.4 51.4,11.4 | 51.4,11.4 50.8,11.4 | 50.8,11.4 50.8,13.34 v50.77,13.52
  Signal_Bottom 0.275: v50.77,13.52 C124.2 | v84.65,8.23 84.37,8.23 84.3,8.3 | 82.8,12.55 C94.2 | v90.73,9.74 90.73,9.88 IC6.10
  Signal_Bottom 0.279: IC6.4 90.15,13.15 v90.21,13.16 | IC6.39 v89.45,16.4 89.45,17.55 C97.2 | 82.9,11.65 C95.2 | 82.8,13.65 C252.2 | IC6.21 84.67,10.07 84.3,9.7 84.3,8.3 84.3,8 83.8,7.5 C96.2 | IC6.24 83.55,11.65 v83.55,11.95
  Signal_Bottom 0.406: 82.8,13.75 C252.2
  Signal_Bottom 0.61: C252.2 C94.2 C95.2 | v50.37,8.32 C125.2 | D10.5 v38.39,8.32 | v56.9,11.4 62.8,11.4 64.75,9.45 66.9,9.45 70.15,6.2 76.9,6.2 77.3,6.6 v77.3,10.05 L4.2
  other vias: 83.55,12.55 84.9,15.55
  pour VCC (no thermals): 77.05,11.1 77.05,6.25 93.8,6.25 93.8,16.8 80.5,16.8 80.5,11.1
  pour Signal_Bottom (no thermals): 84.2,14.2 84.2,13.1 85.15,13.1 85.15,14.2